# EAGLE design S7G7_footprint_simplified_w_ethernet_Power_Meter_v1p21 (EAGLE 9.6.2)
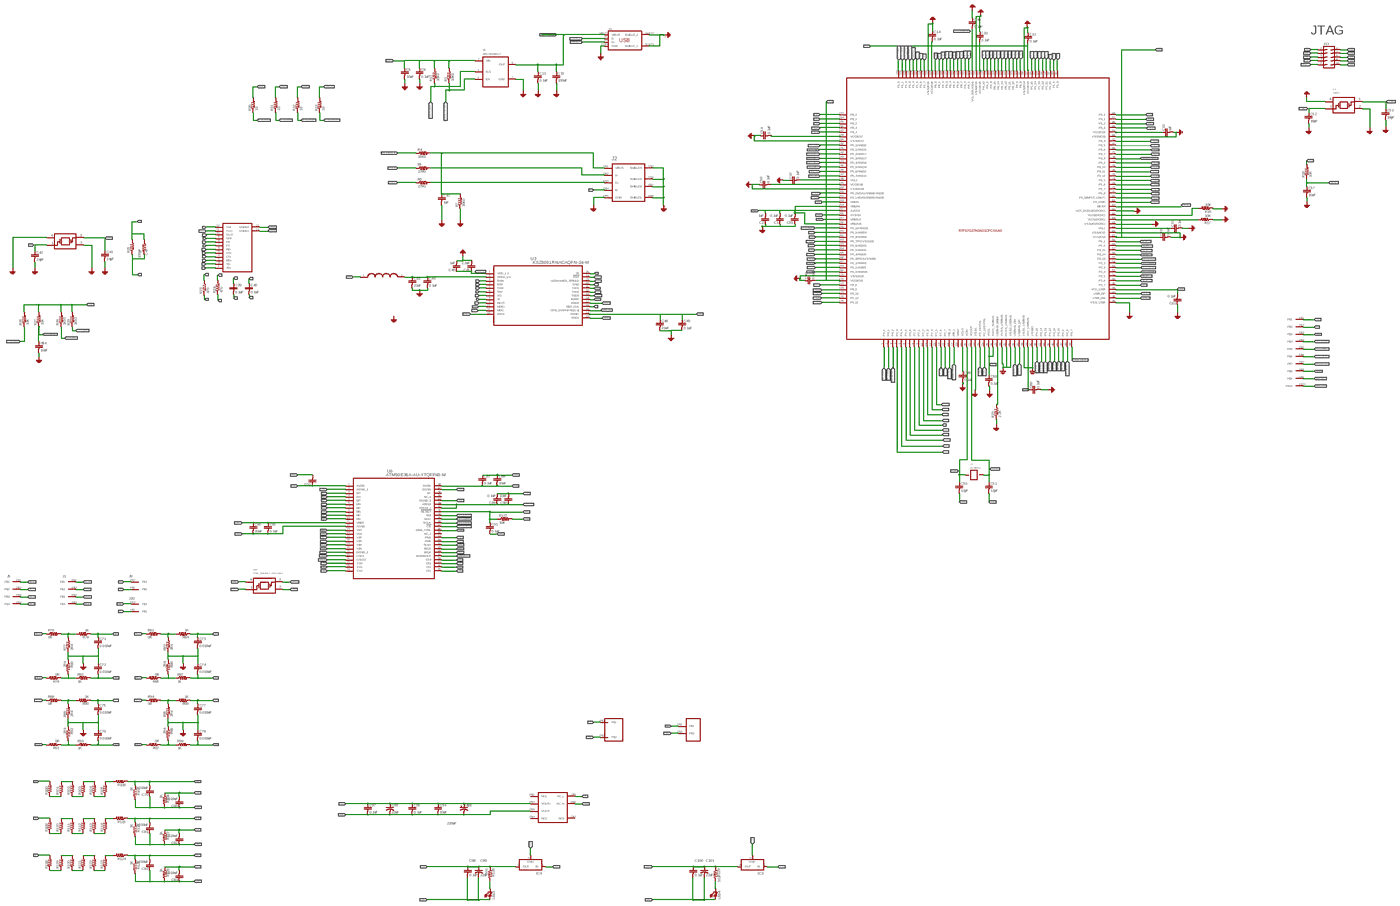
[diagram p0: schematic, sheet 1, overview]
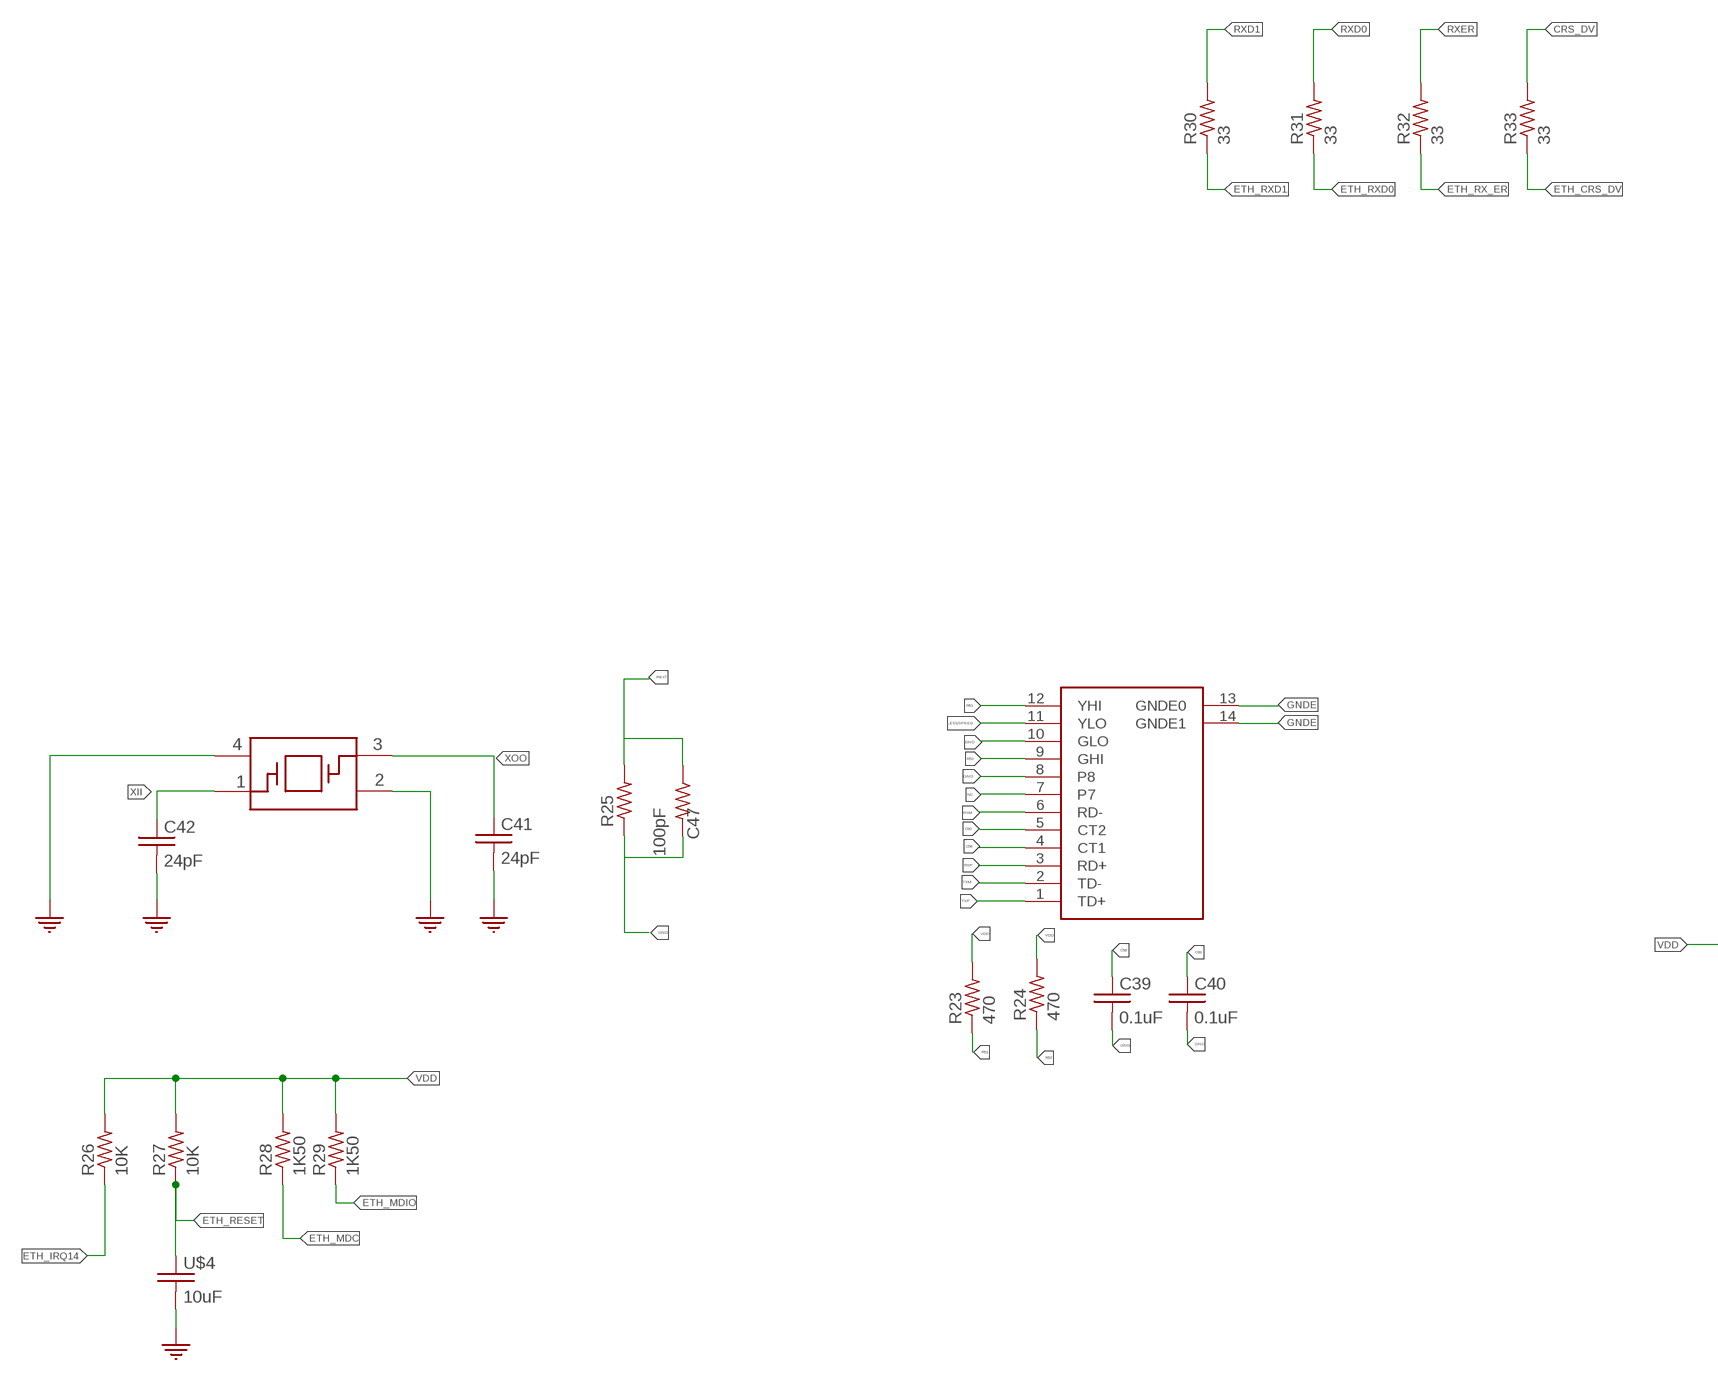
[diagram p1: schematic, sheet 1, part 1 of 6]
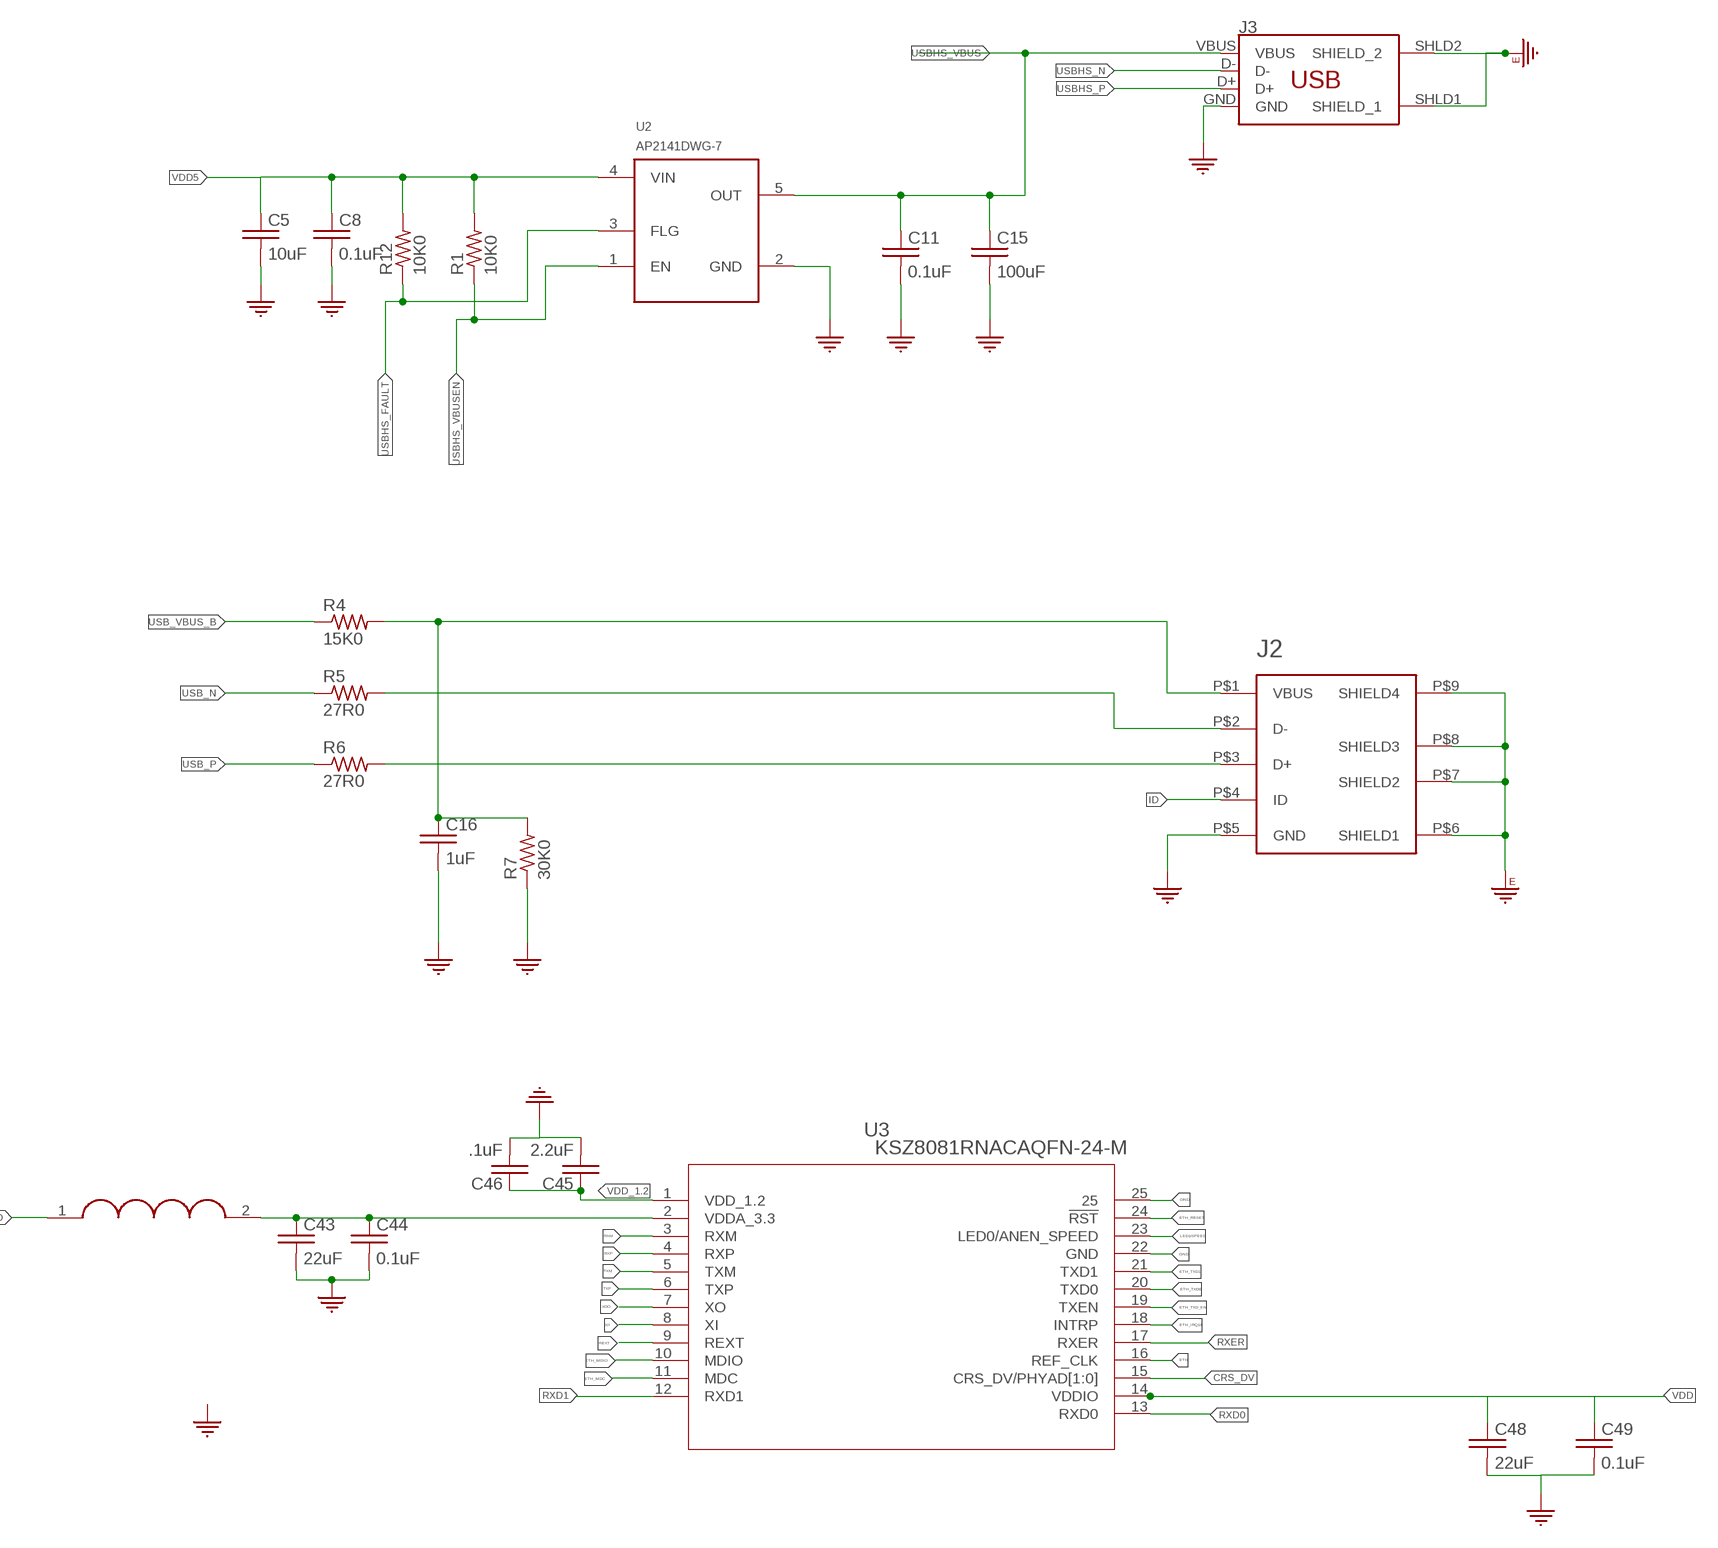
[diagram p2: schematic, sheet 1, part 2 of 6]
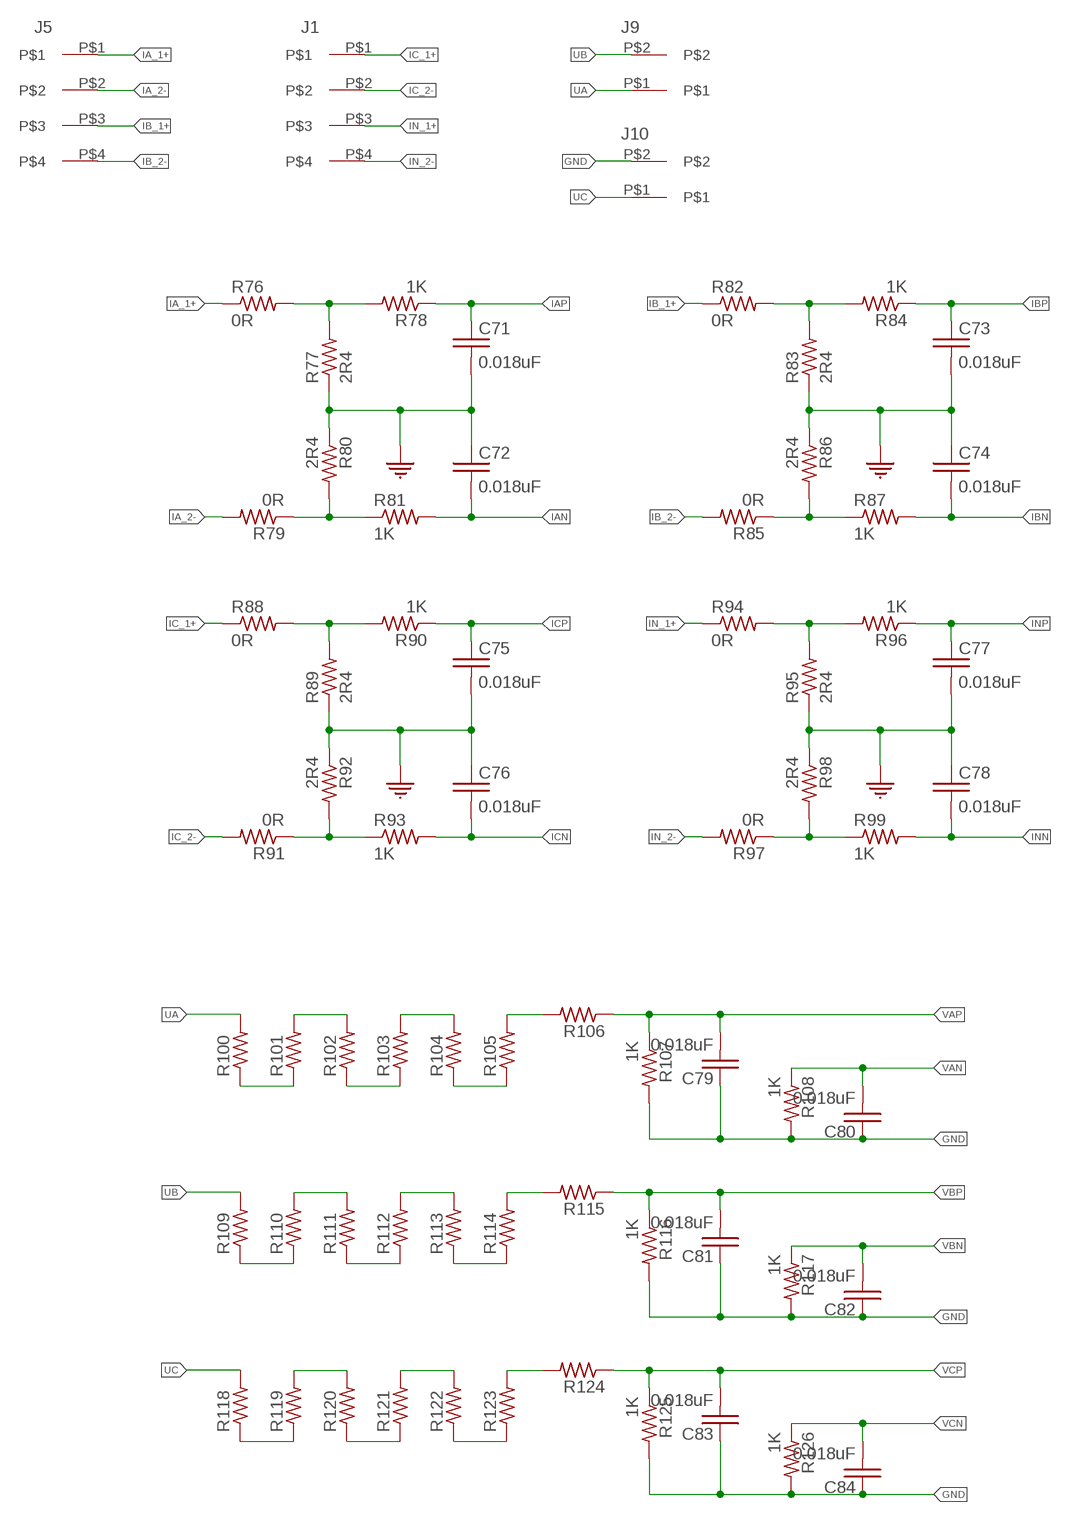
[diagram p3: schematic, sheet 1, part 3 of 6]
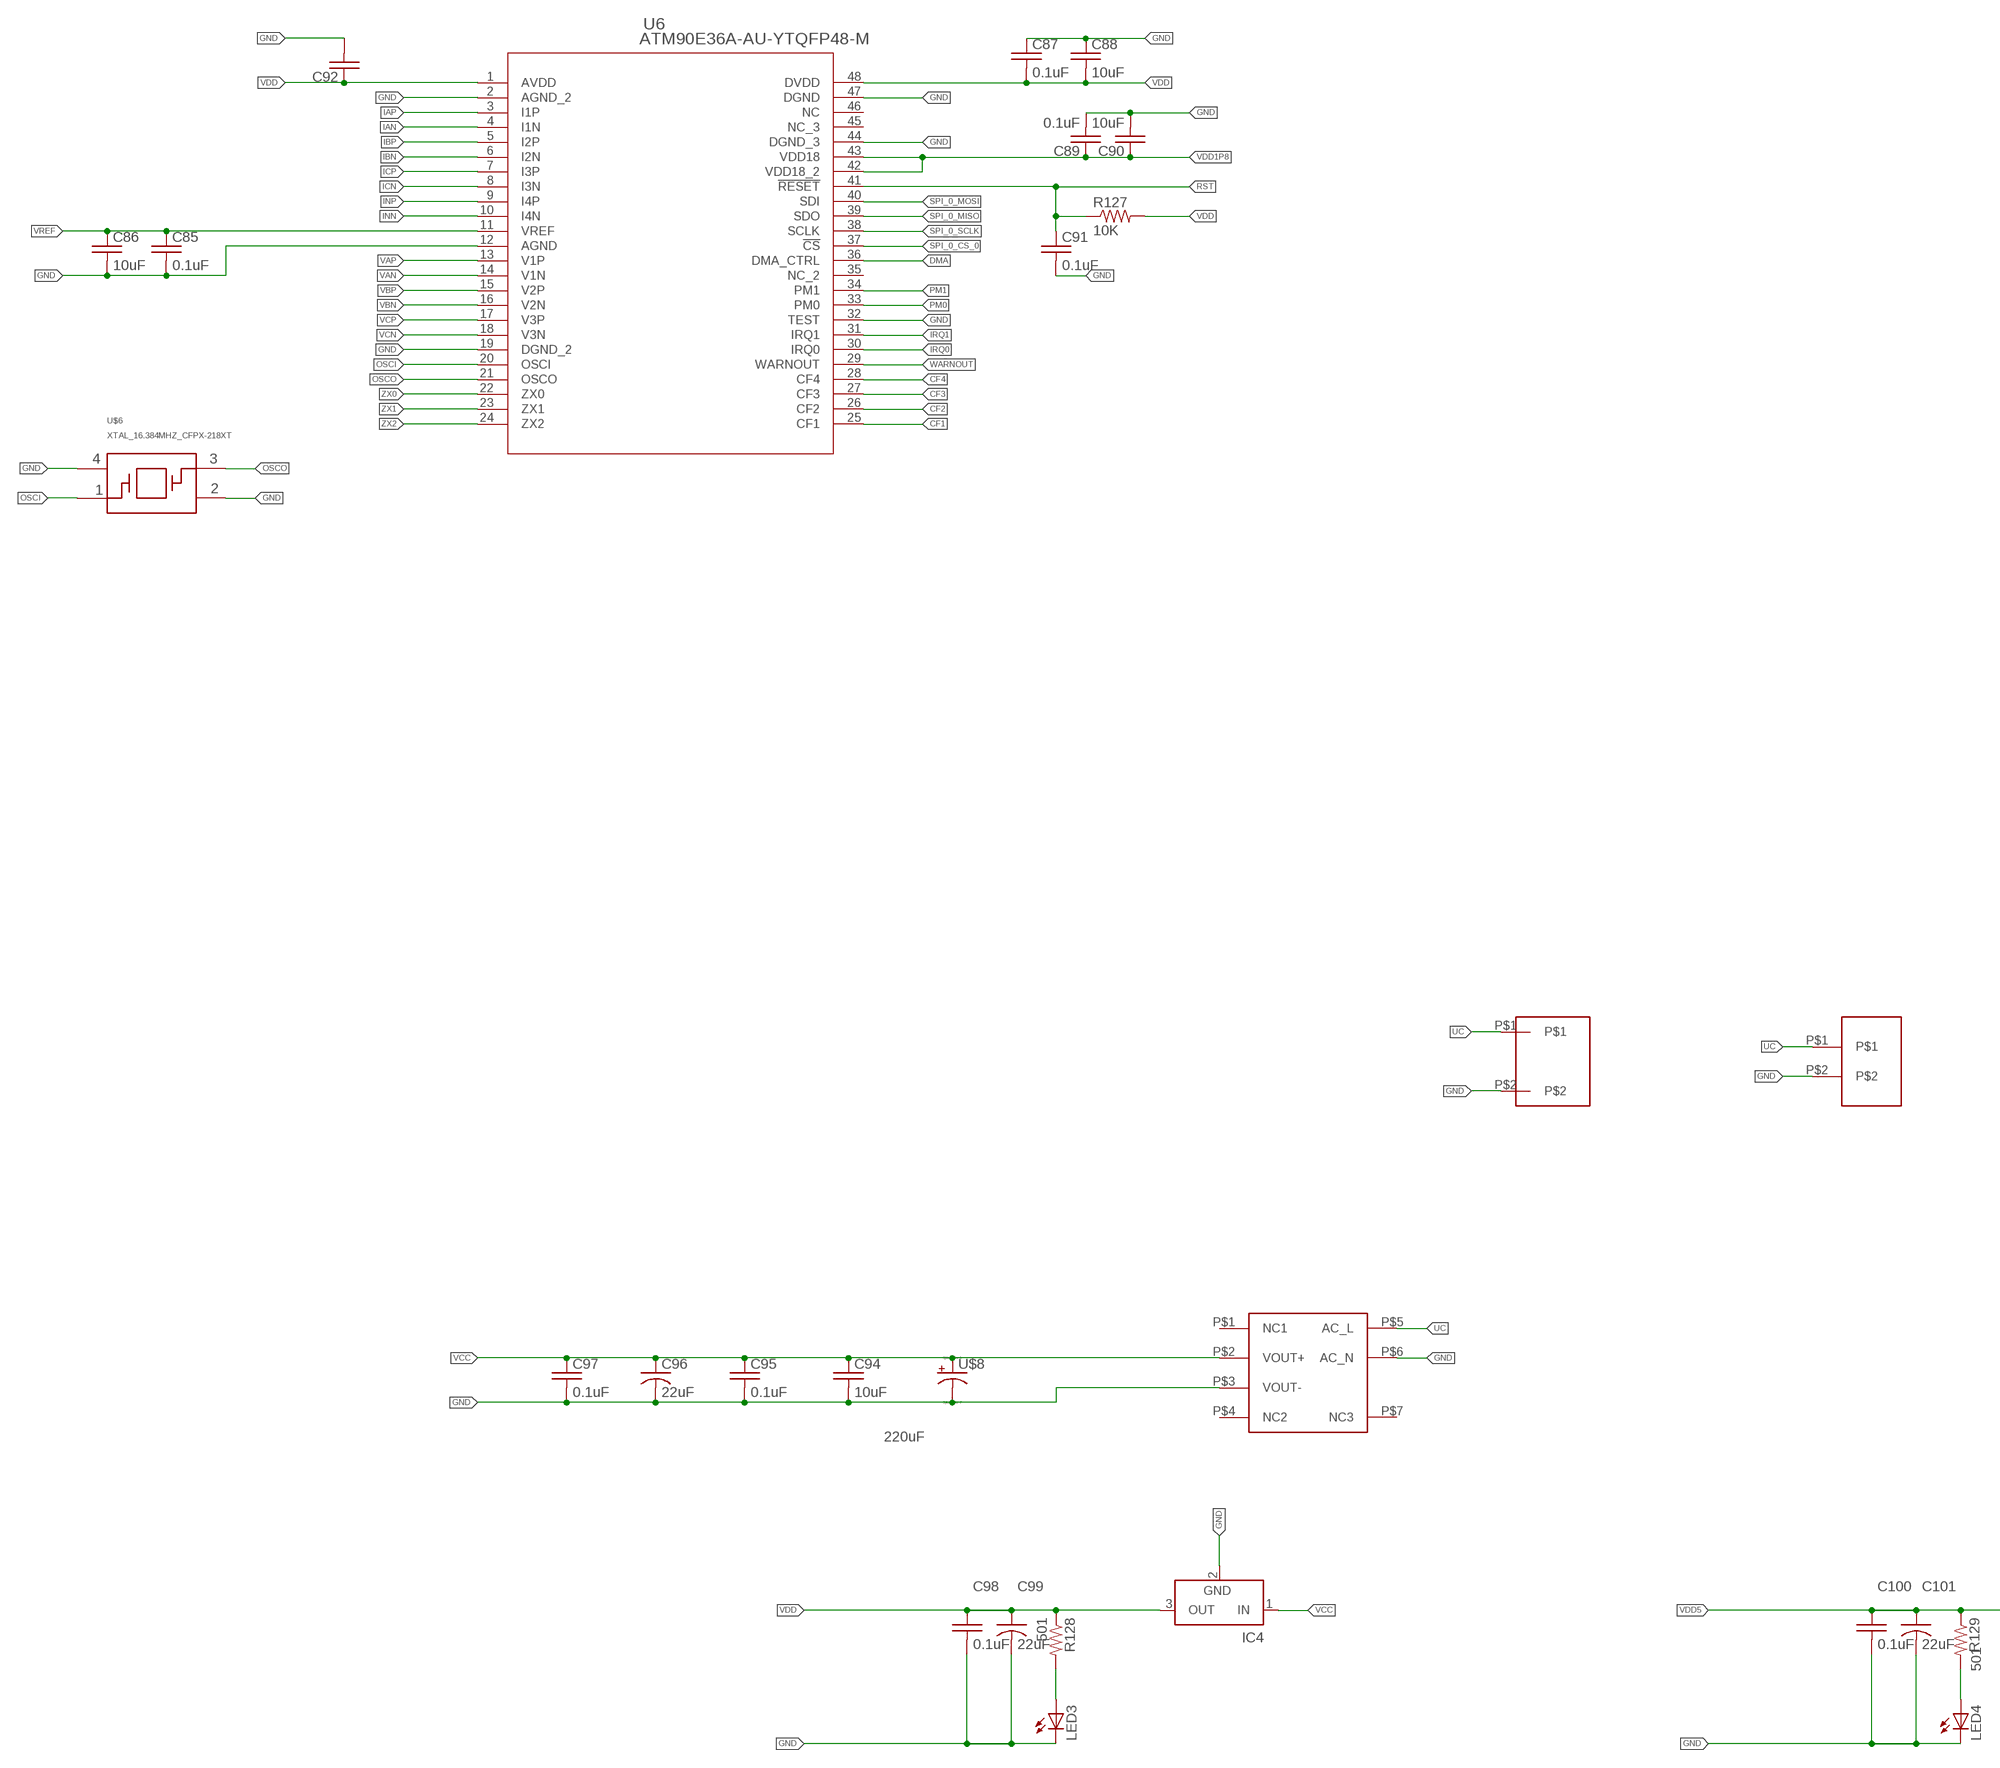
[diagram p4: schematic, sheet 1, part 4 of 6]
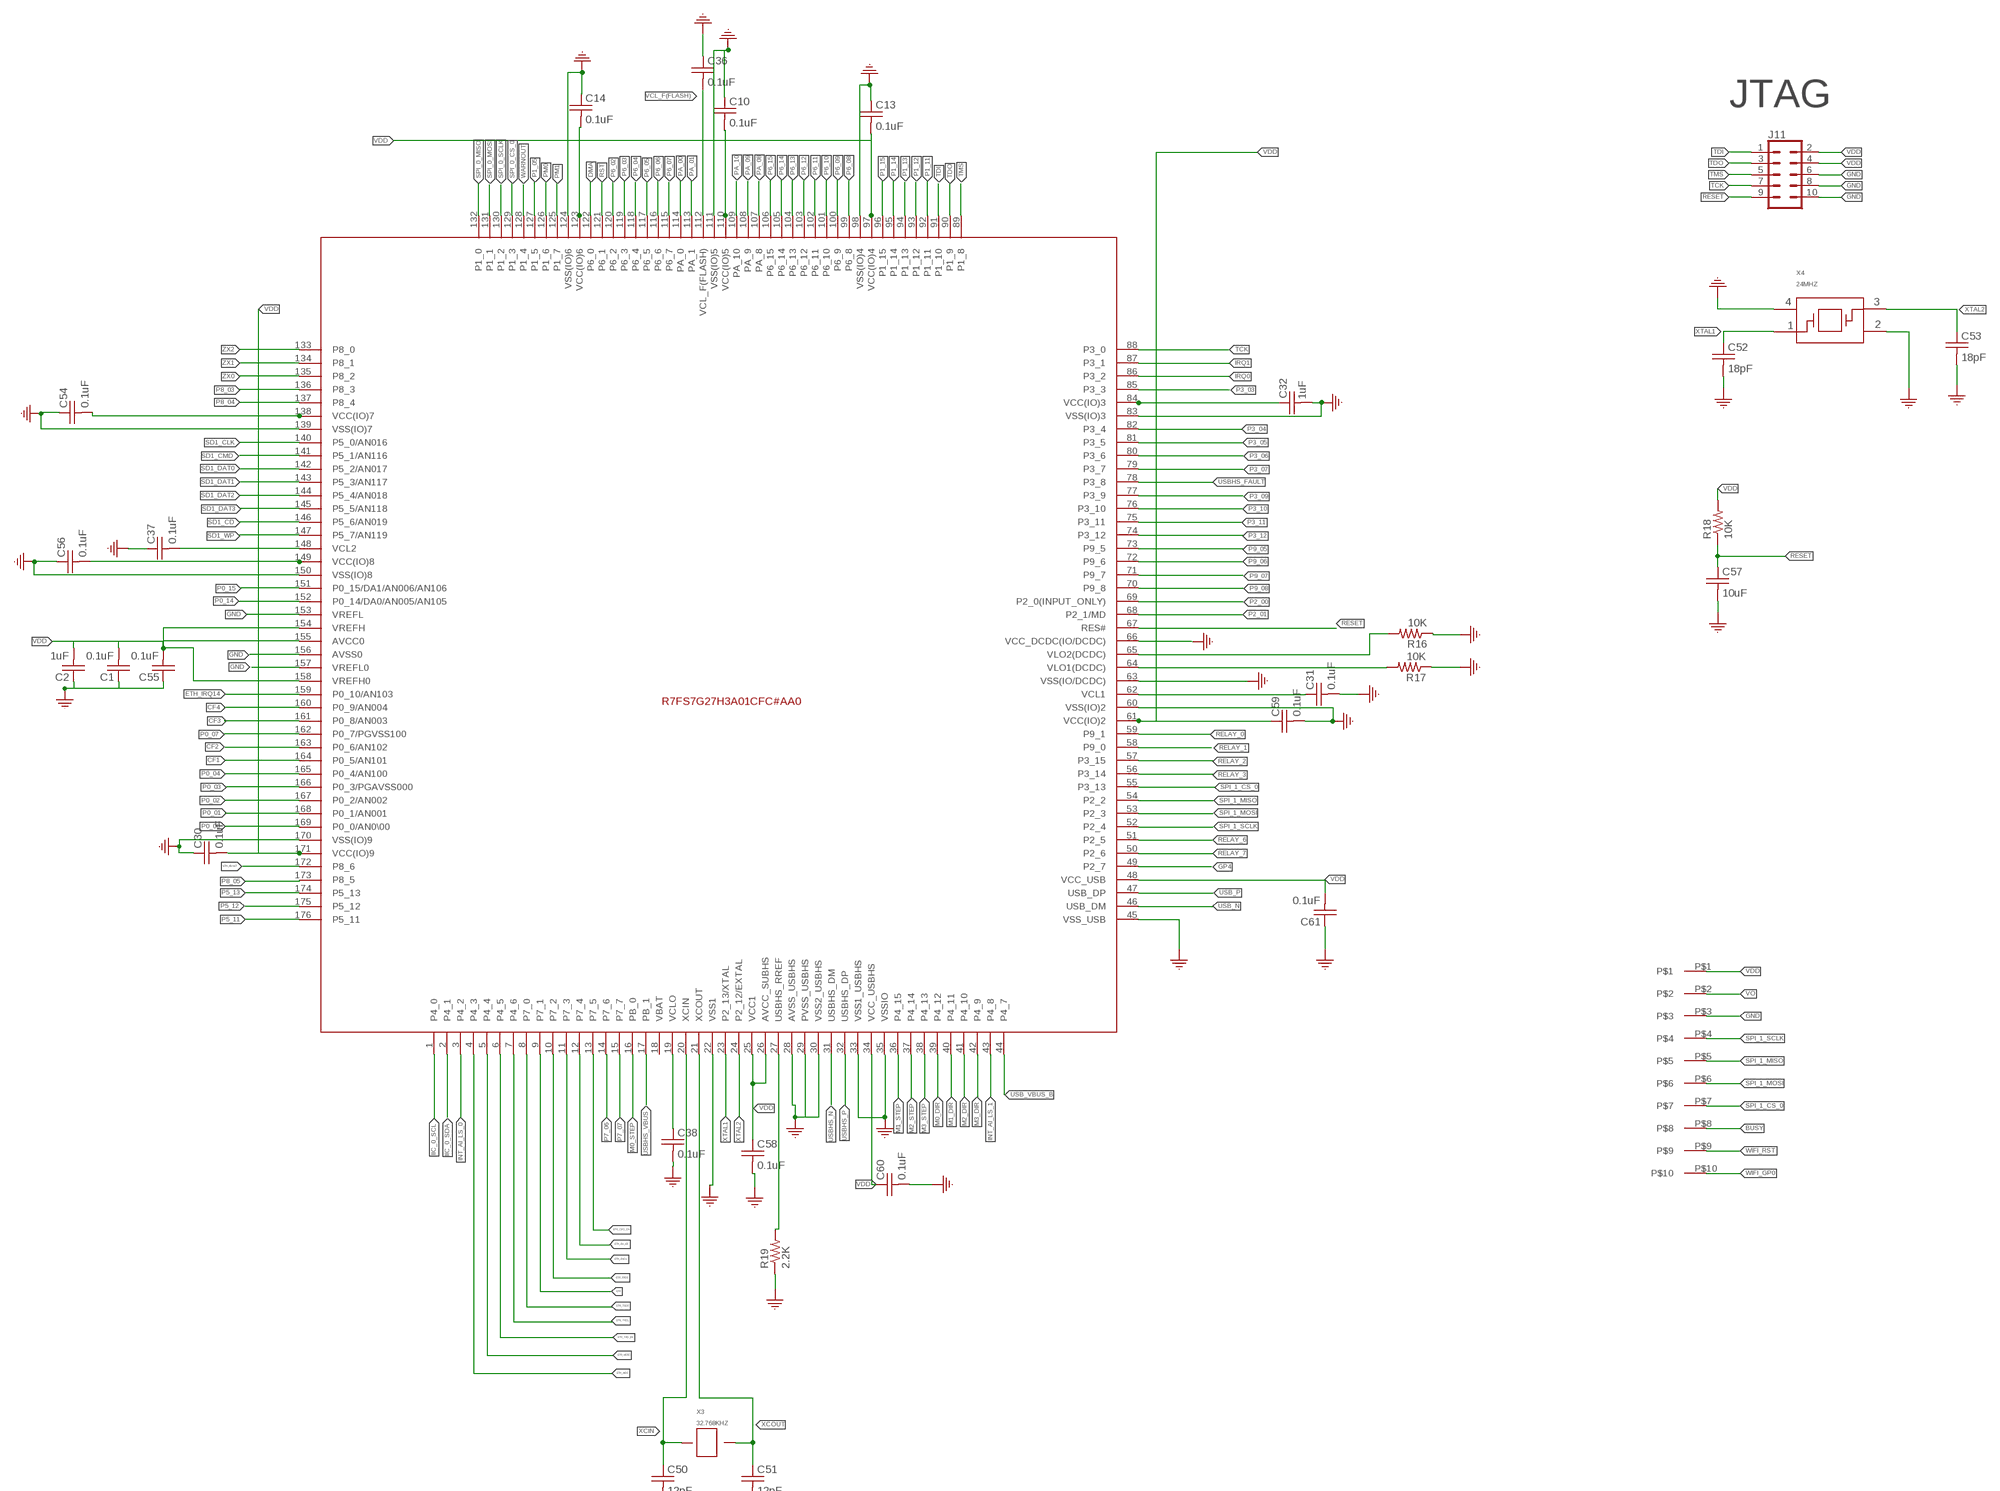
[diagram p5: schematic, sheet 1, part 5 of 6]
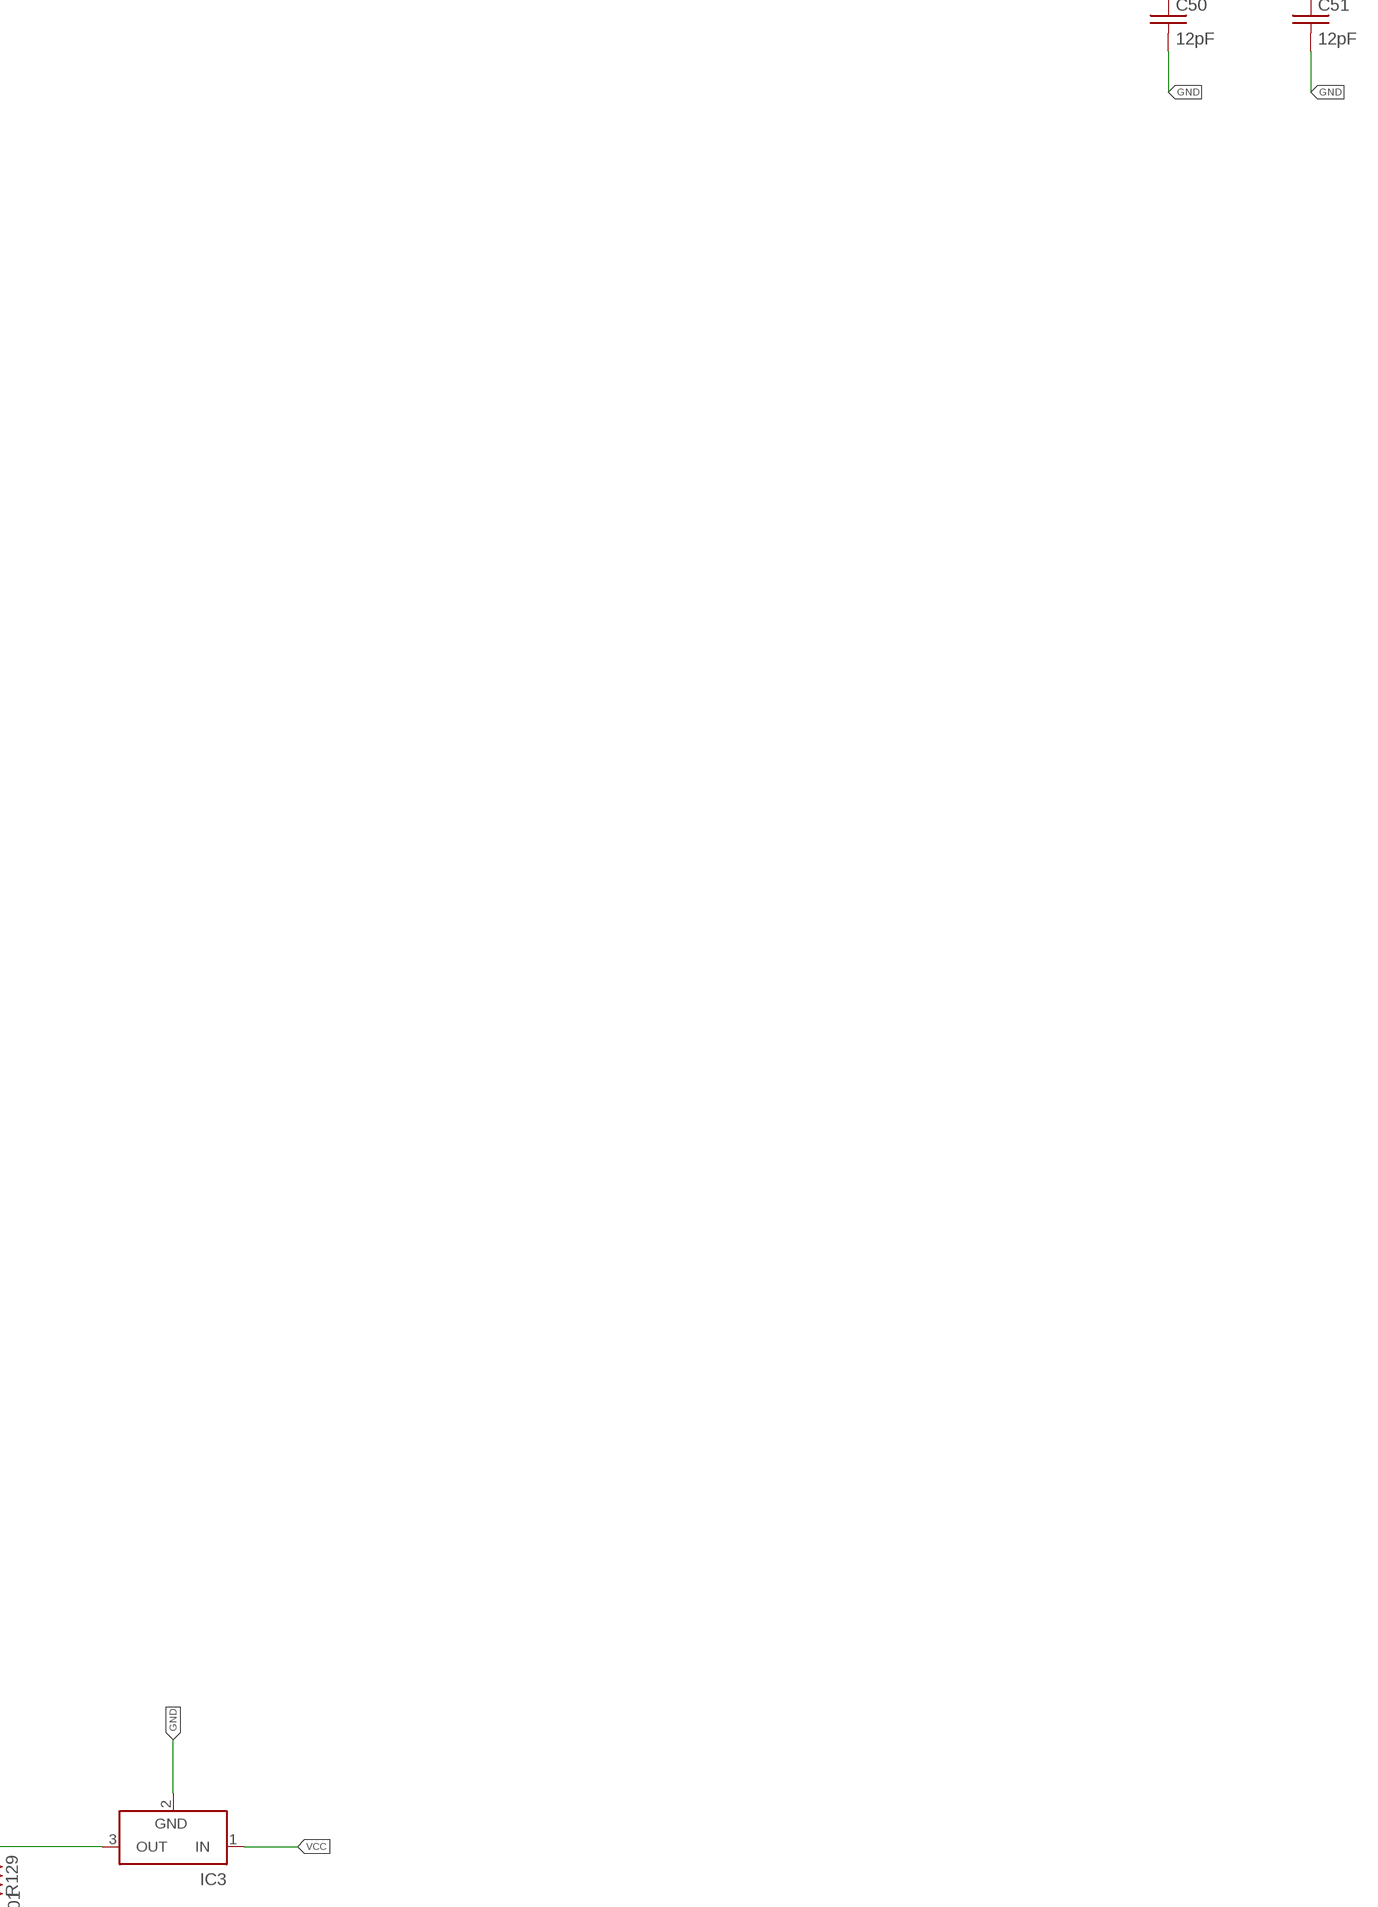
[diagram p6: schematic, sheet 1, part 6 of 6]

## Parts
C1  0.1uF  C_0402  [0402]
C2  1uF  C_0402  [0402]
C5  10uF  C_0402  [0402]
C8  0.1uF  C_0402  [0402]
C10  0.1uF  C_0402  [0402]
C11  0.1uF  C_0402  [0402]
C13  0.1uF  C_0402  [0402]
C14  0.1uF  C_0402  [0402]
C15  100uF  C_1210  [C1210]
C16  1uF  C_0402  [0402]
C30  0.1uF  C_0402  [0402]
C31  0.1uF  C_0402  [0402]
C32  1uF  C_0402  [0402]
C36  0.1uF  C_0402  [0402]
C37  0.1uF  C_0402  [0402]
C38  0.1uF  C_0402  [0402]
C39  0.1uF  C_0402  [0402]
C40  0.1uF  C_0402  [0402]
C41  24pF  C_0402  [0402]
C42  24pF  C_0402  [0402]
C43  22uF  C_0603  [0603]
C44  0.1uF  C_0402  [0402]
C45  2.2uF  C_0402  [0402]
C46  .1uF  C_0402  [0402]
C47  100pF  R_0402  [0402]
C48  22uF  C_0603  [0603]
C49  0.1uF  C_0402  [0402]
C50  12pF  C_0402  [0402]
C51  12pF  C_0402  [0402]
C52  18pF  C_0402  [0402]
C53  18pF  C_0402  [0402]
C54  0.1uF  C_0402  [0402]
C55  0.1uF  C_0402  [0402]
C56  0.1uF  C_0402  [0402]
C57  10uF  C_0402  [0402]
C58  0.1uF  C_0402  [0402]
C59  0.1uF  C_0402  [0402]
C60  0.1uF  C_0402  [0402]
C61  0.1uF  C_0402  [0402]
C71  0.018uF  C_0402  [0402]
C72  0.018uF  C_0402  [0402]
C73  0.018uF  C_0402  [0402]
C74  0.018uF  C_0402  [0402]
C75  0.018uF  C_0402  [0402]
C76  0.018uF  C_0402  [0402]
C77  0.018uF  C_0402  [0402]
C78  0.018uF  C_0402  [0402]
C79  0.018uF  C_0402  [0402]
C80  0.018uF  C_0402  [0402]
C81  0.018uF  C_0402  [0402]
C82  0.018uF  C_0402  [0402]
C83  0.018uF  C_0402  [0402]
C84  0.018uF  C_0402  [0402]
C85  0.1uF  C_0402  [0402]
C86  10uF  C_0402  [0402]
C87  0.1uF  C_0402  [0402]
C88  10uF  C_0402  [0402]
C89  0.1uF  C_0402  [0402]
C90  10uF  C_0402  [0402]
C91  0.1uF  C_0402  [0402]
C92  C_0402  [0402]
C93  CAP_THIN_FILM_TDK_32922CAP  [CAP_THIN_FILM_32922]
C94  10uF  C_0402  [0402]
C95  0.1uF  C_0402  [0402]
C96  22uF  C-USC1206  [C1206]
C97  0.1uF  C_0402  [0402]
C98  0.1uF  C_0402  [0402]
C99  22uF  C-USC1206  [C1206]
C100  0.1uF  C_0402  [0402]
C101  22uF  C-USC1206  [C1206]
FB2/2  FB_0805_120_OHM  [0805]
IC3  LT1129CST5  [SOT223]
IC4  LT1129CST3  [SOT223]
J1  3.81MM_1_X_4_RT_ANGLE_PLUG_HEADER  [1X4_3.81MM_PITCH]
J2  USB_MICRO-B  [USB_MICRO-B]
J3  USB_A  [USB_A_SMT]
J4  RJ45_WITH_ELEC  [RJ45_TH_ELEC]
J5  3.81MM_1_X_4_RT_ANGLE_PLUG_HEADER  [1X4_3.81MM_PITCH]
J9  3.81MM_1_X_2_RT_ANGLE_PLUG_HEADER  [2_3.81MM_PITCH]
J10  3.81MM_1_X_2_RT_ANGLE_PLUG_HEADER  [2_3.81MM_PITCH]
J11  CONN_05X2PTH  [2X5]
LED3  LED_0805_GREEN  [LED_0805_GREEN]
LED4  LED_0805_GREEN  [LED_0805_GREEN]
R1  10K0  R_0402  [0402]
R4  15K0  R_0402  [0402]
R5  27R0  R_0402  [0402]
R6  27R0  R_0402  [0402]
R7  30K0  R_0402  [0402]
R12  10K0  R_0402  [0402]
R16  10K  R_0402  [0402]
R17  10K  R_0402  [0402]
R18  10K  R_0402  [0402]
R19  2.2K  R_0402  [0402]
R23  470  R_0402  [0402]
R24  470  R_0402  [0402]
R25  6k49  R_0402  [0402]
R26  10K  R_0402  [0402]
R27  10K  R_0402  [0402]
R28  1K50  R_0402  [0402]
R29  1K50  R_0402  [0402]
R30  33  R_0402  [0402]
R31  33  R_0402  [0402]
R32  33  R_0402  [0402]
R33  33  R_0402  [0402]
R76  0R  R_0402  [0402]
R77  2R4  R_0402  [0402]
R78  1K  R_0402  [0402]
R79  0R  R_0402  [0402]
R80  2R4  R_0402  [0402]
R81  1K  R_0402  [0402]
R82  0R  R_0402  [0402]
R83  2R4  R_0402  [0402]
R84  1K  R_0402  [0402]
R85  0R  R_0402  [0402]
R86  2R4  R_0402  [0402]
R87  1K  R_0402  [0402]
R88  0R  R_0402  [0402]
R89  2R4  R_0402  [0402]
R90  1K  R_0402  [0402]
R91  0R  R_0402  [0402]
R92  2R4  R_0402  [0402]
R93  1K  R_0402  [0402]
R94  0R  R_0402  [0402]
R95  2R4  R_0402  [0402]
R96  1K  R_0402  [0402]
R97  0R  R_0402  [0402]
R98  2R4  R_0402  [0402]
R99  1K  R_0402  [0402]
R100  R_0402  [0402]
R101  R_0402  [0402]
R102  R_0402  [0402]
R103  R_0402  [0402]
R104  R_0402  [0402]
R105  R_0402  [0402]
R106  R_0402  [0402]
R107  1K  R_0402  [0402]
R108  1K  R_0402  [0402]
R109  R_0402  [0402]
R110  R_0402  [0402]
R111  R_0402  [0402]
R112  R_0402  [0402]
R113  R_0402  [0402]
R114  R_0402  [0402]
R115  R_0402  [0402]
R116  1K  R_0402  [0402]
R117  1K  R_0402  [0402]
R118  R_0402  [0402]
R119  R_0402  [0402]
R120  R_0402  [0402]
R121  R_0402  [0402]
R122  R_0402  [0402]
R123  R_0402  [0402]
R124  R_0402  [0402]
R125  1K  R_0402  [0402]
R126  1K  R_0402  [0402]
R127  10K  R_0402  [0402]
R128  501  R_0402  [0402]
R129  501  R_0402  [0402]
U2  AP2141DWG-5  [SOT-23-5]
U3  KSZ8081RNACAQFN-24-M  [QFN-24-M]
U4  S7G2_X_176  [LQFP176_24X24]
U6  ATM90E36A-AU-YTQFP48-M  [TQFP48-M]
U7  TMLM_04109  [TMLM04]
U$1  1_X_10_HEADER_GENERIC_.1INCH  [HEADER_1_X_10_.1_INCH]
U$3  XTAL_25_MHZ  [SMD_3225]
U$4  10uF  C_0402  [0402]
U$6  XTAL_16.384MHZ_CFPX-218XT  [XTAL_2.5X2.0]
U$7  VAR_10MM_VDRUS10  [VAR_10MM_VDRUS10]
U$8  220uF  C_AL_ELECTROLYTIC_SMD_220UF  [C_AL_ELECTROLYTIC_SMD_220UF]
X3  32.768KHZ  XTAL_32.768KHZ  [SMD_X_2_PADS]
X4  24MHZ  XTAL_24_MHZ  [SMD_3225]

## Nets
BUSY: U$1.P$8
C58: C39.P$1 J4.4(CT1)
C60: C40.P$1 J4.5(CT2)
CF1: U4.164(P0_5/AN101) U6.25(CF1)
CF2: U4.163(P0_6/AN102) U6.26(CF2)
CF3: U4.161(P0_8/AN003) U6.27(CF3)
CF4: U4.160(P0_9/AN004) U6.28(CF4)
CRS_DV: R33.P$2 U3.15(CRS_DV/PHYAD[1:0])
D+: J2.P$3(D+) R6.P$2
D-: J2.P$2(D-) R5.P$2
DMA: U4.122(P6_0) U6.36(DMA_CTRL)
ETH: U3.16(REF_CLK) U4.9(P7_1)
ETH_CRS_DV: R33.P$1 U4.13(P7_5)
ETH_IRQ14: R26.P$1 U3.18(INTRP) U4.159(P0_10/AN103)
ETH_MDC: R28.P$1 U3.11(MDC) U4.4(P4_3)
ETH_MDIO: R29.P$1 U3.10(MDIO) U4.5(P4_4)
ETH_RESET: R27.P$1 U3.24(!RST) U4.172(P8_6) U$4.P$1
ETH_RX_ER: R32.P$1 U4.12(P7_4)
ETH_RXD0: R31.P$1 U4.10(P7_2)
ETH_RXD1: R30.P$1 U4.11(P7_3)
ETH_TXD0: U3.20(TXD0) U4.8(P7_0)
ETH_TXD1: U3.21(TXD1) U4.7(P4_6)
ETH_TXD_EN: U3.19(TXEN) U4.6(P4_5)
GND: C1.P$1 C2.P$1 C5.P$2 C8.P$2 C10.P$1 C11.P$2 C13.P$1 C14.P$1 C15.2 C16.P$2 C30.P$1 C31.P$2 C32.P$2 C36.P$1 C37.P$1 C38.P$2 C39.P$2 C40.P$2 C41.P$2 C42.P$2 C43.2 C44.P$2 C45.P$2 C46.P$2 C47.P$2 C48.2 C49.P$2 C50.P$2 C51.P$2 C52.P$2 C53.P$2 C54.P$1 C55.P$1 C56.P$1 C57.P$2 C58.P$2 C59.P$2 C60.P$2 C61.P$1 C71.P$2 C72.P$1 C73.P$2 C74.P$1 C75.P$2 C76.P$1 C77.P$2 C78.P$1 C79.P$1 C80.P$1 C81.P$1 C82.P$1 C83.P$1 C84.P$1 C85.P$2 C86.P$2 C87.P$1 C88.P$1 C89.P$2 C90.P$2 C91.P$2 C92.P$2 C93.P$2 C94.P$2 C95.P$2 C96.2 C97.P$2 C98.P$2 C99.2 C100.P$2 C101.2 IC3.2(GND) IC4.2(GND) J2.P$5(GND) J3.GND J4.8 J4.10(GLO) J10.P$2 J11.6 J11.8 J11.10 LED3.C LED4.C R7.P$1 R16.P$1 R17.P$1 R19.P$1 R25.P$1 R77.P$1 R80.P$1 R83.P$1 R86.P$1 R89.P$1 R92.P$1 R95.P$1 R98.P$1 R107.P$2 R108.P$2 R116.P$2 R117.P$2 R125.P$2 R126.P$2 U2.2(GND) U3.22(GND) U3.25 U4.22(VSS1) U4.28(AVSS_USBHS) U4.29(PVSS_USBHS) U4.30(VSS2_USBHS) U4.33(VSS1_USBHS) U4.35(VSSIO) U4.45(VSS_USB) U4.60(VSS(IO)2) U4.63(VSS(IO/DCDC)) U4.66(VCC_DCDC(IO/DCDC)) U4.83(VSS(IO)3) U4.98(VSS(IO)4) U4.111(VSS(IO)5) U4.124(VSS(IO)6) U4.139(VSS(IO)7) U4.150(VSS(IO)8) U4.153(VREFL) U4.156(AVSS0) U4.157(VREFL0) U4.170(VSS(IO)9) U6.2(AGND_2) U6.12(AGND) U6.19(DGND_2) U6.32(TEST) U6.44(DGND_3) U6.47(DGND) U7.P$3(VOUT-) U7.P$6(AC_N) U$1.P$3 U$3.2 U$3.4 U$4.P$2 U$6.2 U$6.4 U$7.P$2 U$8.N-(-) X4.2 X4.4
GNDE: J2.P$6(SHIELD1) J2.P$7(SHIELD2) J2.P$8(SHIELD3) J2.P$9(SHIELD4) J3.SHLD1(SHIELD_1) J3.SHLD2(SHIELD_2) J4.13(GNDE0) J4.14(GNDE1)
GP4: U4.49(P2_7)
IA_1+: J5.P$1 R76.P$1
IA_2-: J5.P$2 R79.P$2
IAN: C72.P$2 R81.P$2 U6.4(I1N)
IAP: C71.P$1 R78.P$1 U6.3(I1P)
IB_1+: J5.P$3 R82.P$1
IB_2-: J5.P$4 R85.P$2
IBN: C74.P$2 R87.P$2 U6.6(I2N)
IBP: C73.P$1 R84.P$1 U6.5(I2P)
IC_1+: J1.P$1 R88.P$1
IC_2-: J1.P$2 R91.P$2
ICN: C76.P$2 R93.P$2 U6.8(I3N)
ICP: C75.P$1 R90.P$1 U6.7(I3P)
ID: J2.P$4(ID)
IIC_0_SCL: U4.1(P4_0)
IIC_0_SDA: U4.2(P4_1)
IN_1+: J1.P$3 R94.P$1
IN_2-: J1.P$4 R97.P$2
INN: C78.P$2 R99.P$2 U6.10(I4N)
INP: C77.P$1 R96.P$1 U6.9(I4P)
INT_AI_LS_0: U4.3(P4_2)
INT_AI_LS_1: U4.43(P4_8)
IRQ0: U4.86(P3_2) U6.30(IRQ0)
IRQ1: U4.87(P3_1) U6.31(IRQ1)
LED1/SPEED: J4.11(YLO) U3.23(LED0/ANEN_SPEED)
M0_DIR: U4.39(P4_12)
M0_STEP: U4.16(PB_0)
M1_DIR: U4.40(P4_11)
M1_STEP: U4.36(P4_15)
M2_DIR: U4.41(P4_10)
M2_STEP: U4.37(P4_14)
M3_DIR: U4.42(P4_9)
M3_STEP: U4.38(P4_13)
N$1: C37.P$2 U4.148(VCL2)
N$4: C38.P$1 U4.19(VCLO)
N$5: C31.P$1 U4.62(VCL1)
N$6: R17.P$2 U4.64(VLO1(DCDC))
N$7: R16.P$2 U4.65(VLO2(DCDC))
N$8: R19.P$2 U4.27(USBHS_RREF)
N$35: R76.P$2 R77.P$2 R78.P$2
N$36: R79.P$1 R80.P$2 R81.P$1
N$37: R82.P$2 R83.P$2 R84.P$2
N$38: R85.P$1 R86.P$2 R87.P$1
N$39: R88.P$2 R89.P$2 R90.P$2
N$40: R91.P$1 R92.P$2 R93.P$1
N$41: R94.P$2 R95.P$2 R96.P$2
N$42: R97.P$1 R98.P$2 R99.P$1
N$43: R100.P$1 R101.P$1
N$44: R101.P$2 R102.P$2
N$45: R102.P$1 R103.P$1
N$46: R103.P$2 R104.P$2
N$47: R104.P$1 R105.P$1
N$48: R105.P$2 R106.P$2
N$49: R109.P$1 R110.P$1
N$50: R110.P$2 R111.P$2
N$51: R111.P$1 R112.P$1
N$52: R112.P$2 R113.P$2
N$53: R113.P$1 R114.P$1
N$54: R114.P$2 R115.P$2
N$55: R118.P$1 R119.P$1
N$56: R119.P$2 R120.P$2
N$57: R120.P$1 R121.P$1
N$58: R121.P$2 R122.P$2
N$59: R122.P$1 R123.P$1
N$60: R123.P$2 R124.P$2
N$61: LED3.A R128.P$2
N$62: LED4.A R129.P$2
NC: J4.7
OSCI: U6.20(OSCI) U$6.1
OSCO: U6.21(OSCO) U$6.3
P0_00: U4.169(P0_0/AN0\00)
P0_01: U4.168(P0_1/AN001)
P0_02: U4.167(P0_2/AN002)
P0_03: U4.166(P0_3/PGAVSS000)
P0_04: U4.165(P0_4/AN100)
P0_07: U4.162(P0_7/PGVSS100)
P0_14: U4.152(P0_14/DA0/AN005/AN105)
P0_15: U4.151(P0_15/DA1/AN006/AN106)
P1_05: U4.127(P1_5)
P1_11: U4.92(P1_11)
P1_12: U4.93(P1_12)
P1_13: U4.94(P1_13)
P1_14: U4.95(P1_14)
P1_15: U4.96(P1_15)
P2_00: U4.69(P2_0(INPUT_ONLY))
P2_01: U4.68(P2_1/MD)
P3_03: U4.85(P3_3)
P3_04: U4.82(P3_4)
P3_05: U4.81(P3_5)
P3_06: U4.80(P3_6)
P3_07: U4.79(P3_7)
P3_09: U4.77(P3_9)
P3_10: U4.76(P3_10)
P3_11: U4.75(P3_11)
P3_12: U4.74(P3_12)
P5_11: U4.176(P5_11)
P5_12: U4.175(P5_12)
P5_13: U4.174(P5_13)
P6_02: U4.120(P6_2)
P6_03: U4.119(P6_3)
P6_04: U4.118(P6_4)
P6_05: U4.117(P6_5)
P6_06: U4.116(P6_6)
P6_07: U4.115(P6_7)
P6_08: U4.99(P6_8)
P6_09: U4.100(P6_9)
P6_10: U4.101(P6_10)
P6_11: U4.102(P6_11)
P6_12: U4.103(P6_12)
P6_13: U4.104(P6_13)
P6_14: U4.105(P6_14)
P6_15: U4.106(P6_15)
P7_06: U4.14(P7_6)
P7_07: U4.15(P7_7)
P8_03: U4.136(P8_3)
P8_04: U4.137(P8_4)
P8_05: U4.173(P8_5)
P9_05: U4.73(P9_5)
P9_06: U4.72(P9_6)
P9_07: U4.71(P9_7)
P9_08: U4.70(P9_8)
PA_00: U4.114(PA_0)
PA_01: U4.113(PA_1)
PA_08: U4.107(PA_8)
PA_09: U4.108(PA_9)
PA_10: U4.109(PA_10)
PM0: U4.126(P1_6) U6.33(PM0)
PM1: U4.125(P1_7) U6.34(PM1)
R51: J4.12(YHI) R23.P$1
R52: J4.9(GHI) R24.P$1
RELAY_0: U4.59(P9_1)
RELAY_1: U4.58(P9_0)
RELAY_2: U4.57(P3_15)
RELAY_3: U4.56(P3_14)
RELAY_6: U4.51(P2_5)
RELAY_7: U4.50(P2_6)
RESET: C57.P$1 J11.9 R18.P$1 U4.67(RES#)
REXT: C47.P$1 R25.P$2 U3.9(REXT)
RST: C91.P$1 R127.P$1 U4.121(P6_1) U6.41(!RESET)
RXD0: R31.P$2 U3.13(RXD0)
RXD1: R30.P$2 U3.12(RXD1)
RXER: R32.P$2 U3.17(RXER)
RXM: J4.6(RD-) U3.3(RXM)
RXP: J4.3(RD+) U3.4(RXP)
SD1_CD: U4.146(P5_6/AN019)
SD1_CLK: U4.140(P5_0/AN016)
SD1_CMD: U4.141(P5_1/AN116)
SD1_DAT0: U4.142(P5_2/AN017)
SD1_DAT1: U4.143(P5_3/AN117)
SD1_DAT2: U4.144(P5_4/AN018)
SD1_DAT3: U4.145(P5_5/AN118)
SD1_WP: U4.147(P5_7/AN119)
SPI_0_CS_0: U4.129(P1_3) U6.37(!CS)
SPI_0_MISO: U4.132(P1_0) U6.39(SDO)
SPI_0_MOSI: U4.131(P1_1) U6.40(SDI)
SPI_0_SCLK: U4.130(P1_2) U6.38(SCLK)
SPI_1_CS_0: U4.55(P3_13) U$1.P$7
SPI_1_MISO: U4.54(P2_2) U$1.P$5
SPI_1_MOSI: U4.53(P2_3) U$1.P$6
SPI_1_SCLK: U4.52(P2_4) U$1.P$4
TCK: J11.7 U4.88(P3_0)
TDI: J11.1 U4.91(P1_10)
TDO: J11.3 U4.90(P1_9)
TMS: J11.5 U4.89(P1_8)
TXM: J4.2(TD-) U3.5(TXM)
TXP: J4.1(TD+) U3.6(TXP)
UA: J9.P$1 R100.P$2
UB: J9.P$2 R109.P$2
UC: C93.P$1 J10.P$1 R118.P$2 U7.P$5(AC_L) U$7.P$1
USB_N: R5.P$1 U4.46(USB_DM)
USB_P: R6.P$1 U4.47(USB_DP)
USB_VBUS_B: R4.P$1 U4.44(P4_7)
USBHS_FAULT: R12.P$1 U2.3(FLG) U4.78(P3_8)
USBHS_N: J3.D- U4.31(USBHS_DM)
USBHS_P: J3.D+ U4.32(USBHS_DP)
USBHS_VBUS: C11.P$1 C15.1 J3.VBUS U2.5(OUT) U4.17(PB_1)
USBHS_VBUSEN: R1.P$1 U2.1(EN)
VAN: C80.P$2 R108.P$1 U6.14(V1N)
VAP: C79.P$2 R106.P$1 R107.P$1 U6.13(V1P)
VBN: C82.P$2 R117.P$1 U6.16(V2N)
VBP: C81.P$2 R115.P$1 R116.P$1 U6.15(V2P)
VBUS: C16.P$1 J2.P$1(VBUS) R4.P$2 R7.P$2
VCC: C94.P$1 C95.P$1 C96.1 C97.P$1 IC3.1(IN) IC4.1(IN) U7.P$2(VOUT+) U$8.P+(+)
VCL_F(FLASH): C36.P$2 U4.112(VCL_F(FLASH))
VCN: C84.P$2 R126.P$1 U6.18(V3N)
VCP: C83.P$2 R124.P$1 R125.P$1 U6.17(V3P)
VDD: C1.P$2 C2.P$2 C10.P$2 C13.P$2 C14.P$2 C30.P$2 C32.P$1 C48.1 C49.P$1 C54.P$2 C55.P$2 C56.P$2 C58.P$1 C59.P$1 C60.P$1 C61.P$2 C87.P$2 C88.P$2 C92.P$1 C98.P$1 C99.1 FB2/2.1 IC4.3(OUT) J11.2 J11.4 R18.P$2 R23.P$2 R24.P$2 R26.P$2 R27.P$2 R28.P$2 R29.P$2 R127.P$2 R128.P$1 U3.14(VDDIO) U4.25(VCC1) U4.26(AVCC_SUBHS) U4.34(VCC_USBHS) U4.48(VCC_USB) U4.61(VCC(IO)2) U4.84(VCC(IO)3) U4.97(VCC(IO)4) U4.110(VCC(IO)5) U4.123(VCC(IO)6) U4.138(VCC(IO)7) U4.149(VCC(IO)8) U4.154(VREFH) U4.155(AVCC0) U4.158(VREFH0) U4.171(VCC(IO)9) U6.1(AVDD) U6.48(DVDD) U$1.P$1
VDD1P8: C89.P$1 C90.P$1 U6.42(VDD18_2) U6.43(VDD18)
VDD5: C5.P$1 C8.P$1 C100.P$1 C101.1 IC3.3(OUT) R1.P$2 R12.P$2 R129.P$1 U2.4(VIN)
VDD_1.2: C45.P$1 C46.P$1 U3.1(VDD_1.2)
VDD_ENET1: C43.1 C44.P$1 FB2/2.2 U3.2(VDDA_3.3)
VO: U$1.P$2
VREF: C85.P$1 C86.P$1 U6.11(VREF)
WARNOUT: U4.128(P1_4) U6.29(WARNOUT)
WIFI_GP0: U$1.P$10
WIFI_RST: U$1.P$9
XCIN: C50.P$1 U4.20(XCIN) X3.P$1
XCOUT: C51.P$1 U4.21(XCOUT) X3.P$2
XII: C42.P$1 U3.8(XI) U$3.1
XOO: C41.P$1 U3.7(XO) U$3.3
XTAL1: C52.P$1 U4.23(P2_13/XTAL) X4.1
XTAL2: C53.P$1 U4.24(P2_12/EXTAL) X4.3
ZX0: U4.135(P8_2) U6.22(ZX0)
ZX1: U4.134(P8_1) U6.23(ZX1)
ZX2: U4.133(P8_0) U6.24(ZX2)
Unconnected: U4.18(VBAT) U6.35(NC_2) U6.45(NC_3) U6.46(NC) U7.P$1(NC1) U7.P$4(NC2) U7.P$7(NC3)

## Notes on the sheet
- JTAG

## Power pins joined to a net without a drawn wire
GND: IC3.4(GND) IC4.4(GND)

## Library data of the parts
C1 C2 C5 C8 C10 C11 C13 C14 C16 C30-C32 C36-C42 C44-C46 C49-C61 C71-C92 C94 C95 C97 C98 C100 U$4 = 3D_MIG_Controller:C_0402
C15 = 3D_MIG_Controller:C_1210
C43 C48 = 3D_MIG_Controller:C_0603
C47 R1 R4-R7 R12 R16-R19 R23-R33 R76-R129 = 3D_MIG_Controller:R_0402
C93 = 3D_MIG_Controller:CAP_THIN_FILM_TDK_32922
C96 C99 C101 = 3D_MIG_Controller:C-US: CAPACITOR, American symbol
FB2/2 = 3D_MIG_Controller:FB_0805_120_OHM
IC3 = 3D_MIG_Controller:LT1129CST5: VOLTAGE REGULATOR with shutdown; MPN: LT1129CST-5#PBF; OC_FARNELL: 1663375; OC_NEWARK: 57M2069
IC4 = 3D_MIG_Controller:LT1129CST3: VOLTAGE REGULATOR with shutdown; MPN: LT1129CST-5#PBF; OC_FARNELL: 1663375; OC_NEWARK: 57M2069
J1 J5 = 3D_MIG_Controller:3.81MM_1_X_4_RT_ANGLE_PLUG_HEADER
J2 = 3D_MIG_Controller:USB_MICRO-B
J3 = 3D_MIG_Controller:USB_A: USB-A Connector Male and female variants, as well as PTH and SMT variants SparkFun Products: SparkFun XBee Explorer Dongle <https://www.sparkfun.com/products/11697> PTH Male SparkFun MicroView-USB Programmer <https://www.sparkfun.com/products/12924> SMT Male SparkFun USB Type A Female Breakout <https://www.sparkfun.com/products/12700> SMT Female
J4 = 3D_MIG_Controller:RJ45_WITH_ELEC
J9 J10 = 3D_MIG_Controller:3.81MM_1_X_2_RT_ANGLE_PLUG_HEADER
J11 = 3D_MIG_Controller:CONN_05X2: Multi connection point. Often used as Generic Header-pin footprint for 0.1 inch spaced/style header connections For AVR SPI programming port, see special device with nice symbol: "AVR_SPI_PROG_5x2.dev" You can populate with any combo of single row headers, but if you'd like an exact match, check these: 2x5 AVR ICSP Male Header <https://www.sparkfun.com/products/778> (PRT-00778) 2x5 Pin Shrouded Header <https://www.sparkfun.com/products/8506> (PRT-08506) On any of the 0.1 inch spaced packages, you can populate with these: Break Away Headers - Straight <https://www.sparkfun.com/products/116> (PRT-00116) Break Away Male Headers - Right Angle <https://www.sparkfun.com/products/553> (PRT-00553) Female Headers <https://www.sparkfun.com/products/115> (PRT-00115) Break Away Headers - Machine Pin <https://www.sparkfun.com/products/117> (PRT-00117) Break Away Female Headers - Swiss Machine Pin <https://www.sparkfun.com/products/743> (PRT-00743) Special note: the shrouded connector mates well with our 5x2 ribbon cables: 2x5 Pin IDC Ribbon Cable <https://www.sparkfun.com/products/8535> (PRT-08535); PROD_ID: CONN-08499; SF_ID: PRT-0778
LED3 LED4 = 3D_MIG_Controller:LED_0805_GREEN
U2 = 3D_MIG_Controller:AP2141DWG-5
U3 = 3D_MIG_Controller:KSZ8081RNACA; MANUFACTURER_PART_NUMBER: KSZ8081RNACA; VENDOR: Micrel
U4 = 3D_MIG_Controller:S7G2_X_176
U6 = 3D_MIG_Controller:ATM90E36A-AU-Y; MANUFACTURER_PART_NUMBER: ATM90E36AAUY; VENDOR: Atmel
U7 = 3D_MIG_Controller:TMLM_04109
U$1 = 3D_MIG_Controller:1_X_10_HEADER_GENERIC_.1INCH
U$3 = 3D_MIG_Controller:XTAL_25_MHZ
U$6 = 3D_MIG_Controller:XTAL_16.384MHZ_CFPX-218
U$7 = 3D_MIG_Controller:VAR_10MM_VDRUS10
U$8 = 3D_MIG_Controller:C_AL_ELECTROLYTIC_SMD_220UF
X3 = 3D_MIG_Controller:XTAL_32.768KHZ
X4 = 3D_MIG_Controller:XTAL_24_MHZ

## Board
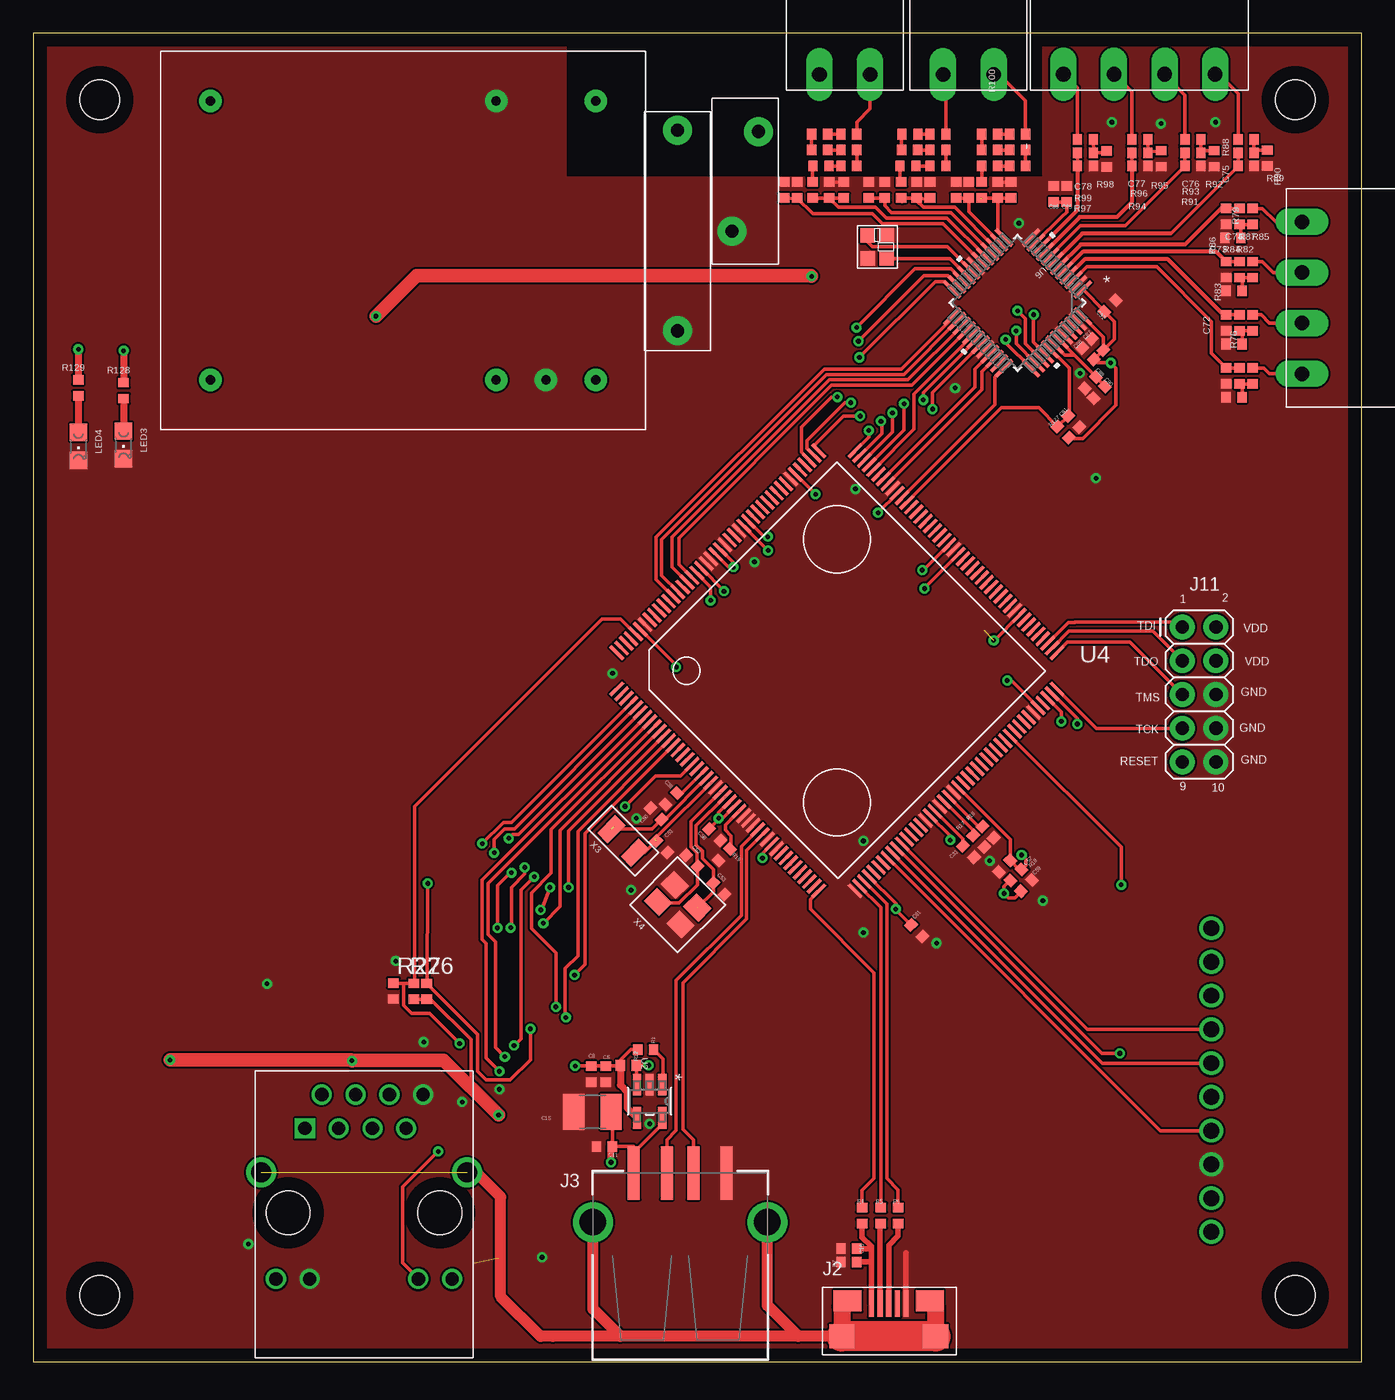
[diagram p7: board, top side]
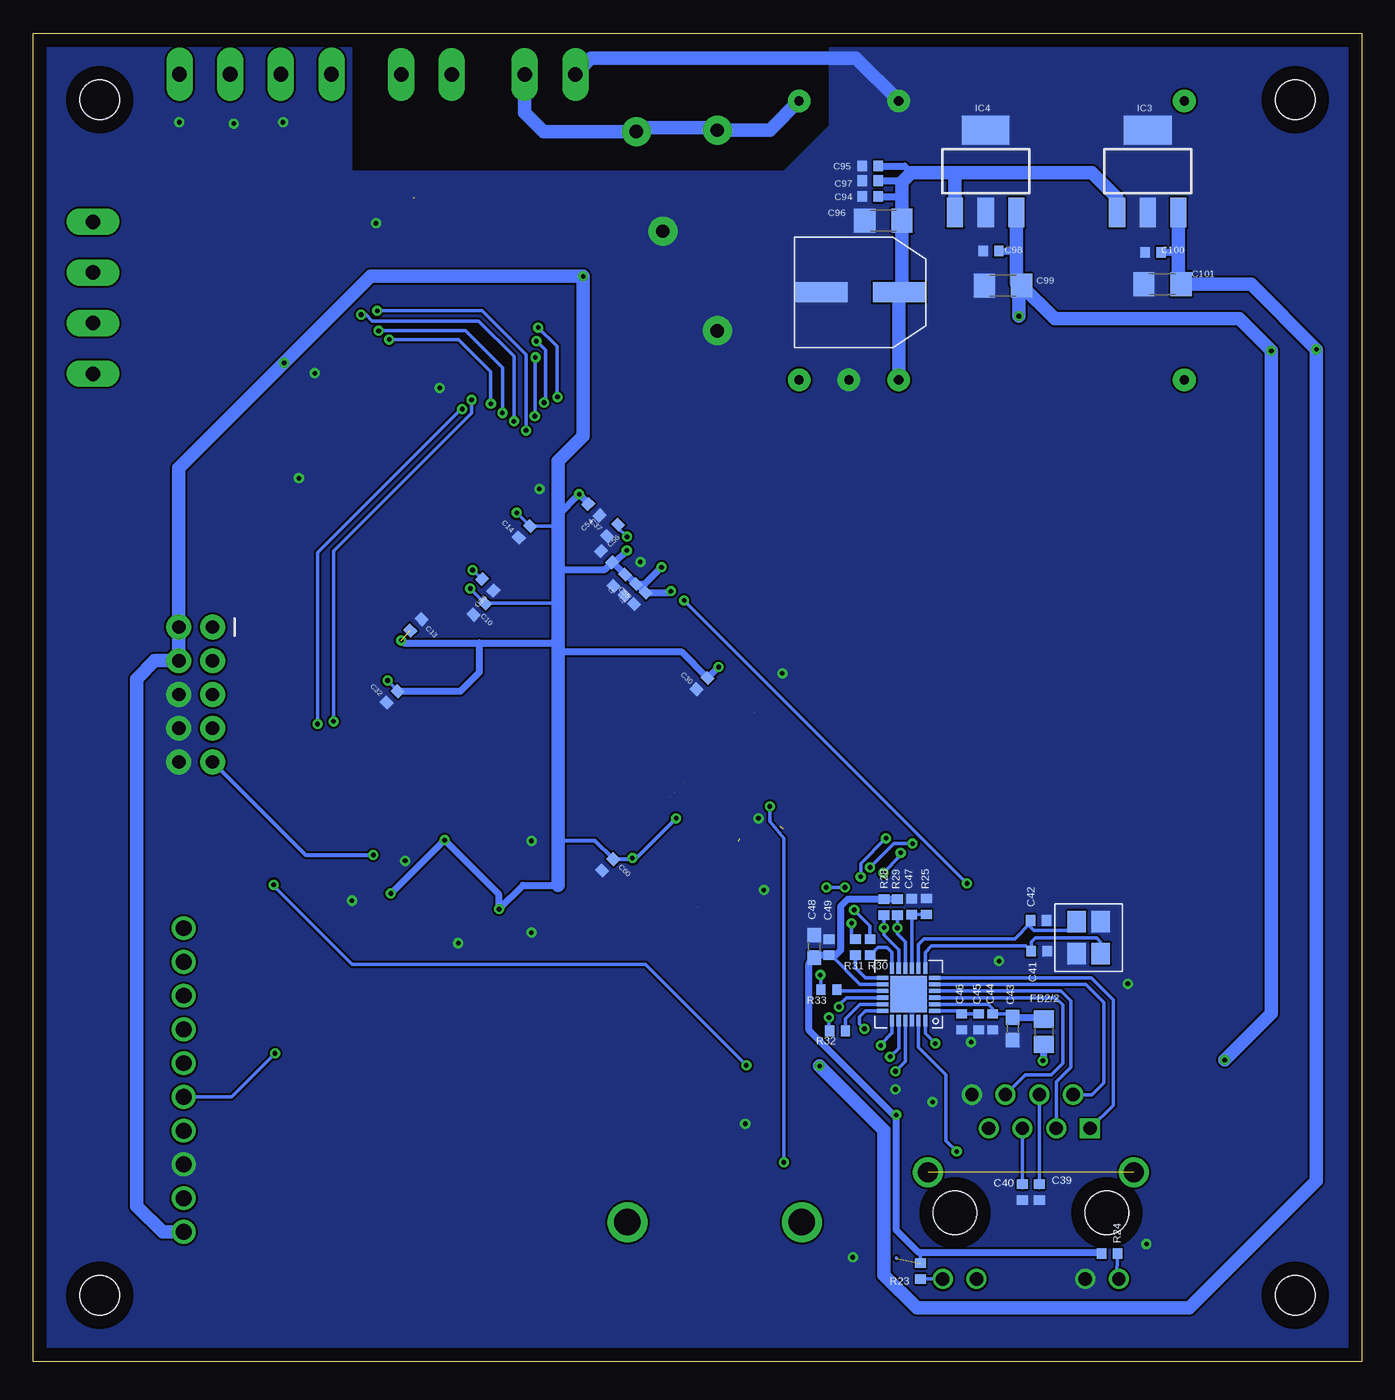
[diagram p8: board, bottom side, seen from below]

Size 100 x 100 mm. Coordinates in mm from the lower left corner, seen from the top.
Outline: 0,0 100,0 100,100 0,100 0,0
Copper layers (1*16): Top 0.035mm / dielectric 1.5mm / Bottom 0.035mm
Design rules "default": minimum track width 6mil, minimum drill 0.35mm, track to track 6mil, track to pad 6mil, pad to pad 6mil, via to via 6mil, smd to smd 6mil, copper to edge 40mil, drill to drill 6mil, minimum pad ring 10mil, minimum via ring 8mil, stop-mask expansion 4mil, vias tented up to drill 0mil, thermal gap 10mil
Holes 3 mm at 5,95 95,95 95,5 5,5

### Footprints (pad centres in the part's own frame; a part is rotated, then mirrored left to right if it is on the bottom)
0402 = smd 0.8 x 0.7: P$1 0,0.6; P$2 0,-0.6
C1210 = smd 1.6 x 2.7: 1 -1.4,0; 2 1.4,0
0603 = smd 1.1 x 1: 1 -0.85,0; 2 0.85,0
CAP_THIN_FILM_32922 = drill 1 pad 2.184: P$1 -0.1,0; P$2 15,0
C1206 = smd 1.6 x 1.8: 1 -1.4,0; 2 1.4,0
0805 = smd 1.3 x 1.5: 1 -0.95,0; 2 0.95,0
SOT223 = smd 1.219 x 2.235: 1 -2.311,-3.099; 2 0,-3.099; 3 2.311,-3.099 | smd 3.6 x 2.2: 4 0,3.099
1X4_3.81MM_PITCH = drill 1.1 pad 2 long: P$1 0,0; P$2 3.81,0; P$3 7.62,0; P$4 11.43,0
USB_MICRO-B = smd 0.4 x 2: P$1 -1.3,2.475; P$2 -0.65,2.475; P$3 0,2.475; P$4 0.65,2.475; P$5 1.3,2.475 | smd 2.1 x 1.6: P$6 -3.1,2.675; P$7 3.1,2.675 | smd 1.9 x 1.8: P$8 -3.525,0; P$9 3.525,0
USB_A_SMT = smd 4 x 0.9: D+ 6.7,-1; D- 6.7,1; GND 6.7,-3.5; VBUS 6.7,3.5 | drill 2: SHLD1 3,-6.566; SHLD2 3,6.566
RJ45_TH_ELEC = drill 1 square: 1 -4.45,-2.54 | drill 1: 2 -3.18,0; 3 -1.91,-2.54; 4 -0.635,0; 5 0.635,-2.54; 6 1.91,0; 7 3.17,-2.54; 8 4.445,0; 9 -6.63,-13.88; 10 -4.09,-13.88; 11 4.09,-13.88; 12 6.63,-13.88 | drill 1.5: 13 -7.75,-5.84; 14 7.75,-5.84 | hole 3.299: 5.715,-8.89; -5.715,-8.89
2_3.81MM_PITCH = drill 1.1 pad 2 long: P$1 0,0; P$2 3.81,0
2X5 = drill 1 pad 1.88: 1 0,0; 2 0,2.54; 3 2.54,0; 4 2.54,2.54; 5 5.08,0; 6 5.08,2.54; 7 7.62,0; 8 7.62,2.54; 9 10.16,0; 10 10.16,2.54
LED_0805_GREEN = smd 1.3 x 1.3: A 0,-1.05; C 0,1.05
SOT-23-5 = smd 1.626 x 0.61: 1 -1.245,0.95; 2 -1.245,0; 3 -1.245,-0.95; 4 1.245,-0.95; 5 1.245,0.95
QFN-24-M = smd 0.864 x 0.305: 1 -1.968,1.25; 2 -1.968,0.75; 3 -1.968,0.25; 4 -1.968,-0.25; 5 -1.968,-0.75; 6 -1.968,-1.25; 13 1.968,-1.25; 14 1.968,-0.75; 15 1.968,-0.25; 16 1.968,0.25; 17 1.968,0.75; 18 1.968,1.25 | smd 0.305 x 0.864: 7 -1.25,-1.968; 8 -0.75,-1.968; 9 -0.25,-1.968; 10 0.25,-1.968; 11 0.75,-1.968; 12 1.25,-1.968; 19 1.25,1.968; 20 0.75,1.968; 21 0.25,1.968; 22 -0.25,1.968; 23 -0.75,1.968; 24 -1.25,1.968 | smd 2.743 x 2.743: 25 0,0
LQFP176_24X24 = smd 1.372 x 0.254: 1 -12.675,10.75; 2 -12.675,10.25; 3 -12.675,9.75; 4 -12.675,9.25; 5 -12.675,8.75; 6 -12.675,8.25; 7 -12.675,7.75; 8 -12.675,7.25; 9 -12.675,6.75; 10 -12.675,6.25; 11 -12.675,5.75; 12 -12.675,5.25; 13 -12.675,4.75; 14 -12.675,4.25; 15 -12.675,3.75; 16 -12.675,3.25; 17 -12.675,2.75; 18 -12.675,2.25; 19 -12.675,1.75; 20 -12.675,1.25; 21 -12.675,0.75; 22 -12.675,0.25; 23 -12.675,-0.25; 24 -12.675,-0.75; 25 -12.675,-1.25; 26 -12.675,-1.75; 27 -12.675,-2.25; 28 -12.675,-2.75; 29 -12.675,-3.25; 30 -12.675,-3.75; 31 -12.675,-4.25; 32 -12.675,-4.75; 33 -12.675,-5.25; 34 -12.675,-5.75; 35 -12.675,-6.25; 36 -12.675,-6.75; 37 -12.675,-7.25; 38 -12.675,-7.75; 39 -12.675,-8.25; 40 -12.675,-8.75; 41 -12.675,-9.25; 42 -12.675,-9.75; 43 -12.675,-10.25; 44 -12.675,-10.75; 89 12.675,-10.75; 90 12.675,-10.25; 91 12.675,-9.75; 92 12.675,-9.25; 93 12.675,-8.75; 94 12.675,-8.25; 95 12.675,-7.75; 96 12.675,-7.25; 97 12.675,-6.75; 98 12.675,-6.25; 99 12.675,-5.75; 100 12.675,-5.25; 101 12.675,-4.75; 102 12.675,-4.25; 103 12.675,-3.75; 104 12.675,-3.25; 105 12.675,-2.75; 106 12.675,-2.25; 107 12.675,-1.75; 108 12.675,-1.25; 109 12.675,-0.75; 110 12.675,-0.25; 111 12.675,0.25; 112 12.675,0.75; 113 12.675,1.25; 114 12.675,1.75; 115 12.675,2.25; 116 12.675,2.75; 117 12.675,3.25; 118 12.675,3.75; 119 12.675,4.25; 120 12.675,4.75; 121 12.675,5.25; 122 12.675,5.75; 123 12.675,6.25; 124 12.675,6.75; 125 12.675,7.25; 126 12.675,7.75; 127 12.675,8.25; 128 12.675,8.75; 129 12.675,9.25; 130 12.675,9.75; 131 12.675,10.25; 132 12.675,10.75 | smd 0.254 x 1.372: 45 -10.75,-12.675; 46 -10.25,-12.675; 47 -9.75,-12.675; 48 -9.25,-12.675; 49 -8.75,-12.675; 50 -8.25,-12.675; 51 -7.75,-12.675; 52 -7.25,-12.675; 53 -6.75,-12.675; 54 -6.25,-12.675; 55 -5.75,-12.675; 56 -5.25,-12.675; 57 -4.75,-12.675; 58 -4.25,-12.675; 59 -3.75,-12.675; 60 -3.25,-12.675; 61 -2.75,-12.675; 62 -2.25,-12.675; 63 -1.75,-12.675; 64 -1.25,-12.675; 65 -0.75,-12.675; 66 -0.25,-12.675; 67 0.25,-12.675; 68 0.75,-12.675; 69 1.25,-12.675; 70 1.75,-12.675; 71 2.25,-12.675; 72 2.75,-12.675; 73 3.25,-12.675; 74 3.75,-12.675; 75 4.25,-12.675; 76 4.75,-12.675; 77 5.25,-12.675; 78 5.75,-12.675; 79 6.25,-12.675; 80 6.75,-12.675; 81 7.25,-12.675; 82 7.75,-12.675; 83 8.25,-12.675; 84 8.75,-12.675; 85 9.25,-12.675; 86 9.75,-12.675; 87 10.25,-12.675; 88 10.75,-12.675; 133 10.75,12.675; 134 10.25,12.675; 135 9.75,12.675; 136 9.25,12.675; 137 8.75,12.675; 138 8.25,12.675; 139 7.75,12.675; 140 7.25,12.675; 141 6.75,12.675; 142 6.25,12.675; 143 5.75,12.675; 144 5.25,12.675; 145 4.75,12.675; 146 4.25,12.675; 147 3.75,12.675; 148 3.25,12.675; 149 2.75,12.675; 150 2.25,12.675; 151 1.75,12.675; 152 1.25,12.675; 153 0.75,12.675; 154 0.25,12.675; 155 -0.25,12.675; 156 -0.75,12.675; 157 -1.25,12.675; 158 -1.75,12.675; 159 -2.25,12.675; 160 -2.75,12.675; 161 -3.25,12.675; 162 -3.75,12.675; 163 -4.25,12.675; 164 -4.75,12.675; 165 -5.25,12.675; 166 -5.75,12.675; 167 -6.25,12.675; 168 -6.75,12.675; 169 -7.25,12.675; 170 -7.75,12.675; 171 -8.25,12.675; 172 -8.75,12.675; 173 -9.25,12.675; 174 -9.75,12.675; 175 -10.25,12.675; 176 -10.75,12.675
TQFP48-M = smd 1.716 x 0.27: 1 -4.201,2.75; 2 -4.201,2.25; 3 -4.201,1.75; 4 -4.201,1.25; 5 -4.201,0.75; 6 -4.201,0.25; 7 -4.201,-0.25; 8 -4.201,-0.75; 9 -4.201,-1.25; 10 -4.201,-1.75; 11 -4.201,-2.25; 12 -4.201,-2.75; 25 4.201,-2.75; 26 4.201,-2.25; 27 4.201,-1.75; 28 4.201,-1.25; 29 4.201,-0.75; 30 4.201,-0.25; 31 4.201,0.25; 32 4.201,0.75; 33 4.201,1.25; 34 4.201,1.75; 35 4.201,2.25; 36 4.201,2.75 | smd 0.27 x 1.716: 13 -2.75,-4.201; 14 -2.25,-4.201; 15 -1.75,-4.201; 16 -1.25,-4.201; 17 -0.75,-4.201; 18 -0.25,-4.201; 19 0.25,-4.201; 20 0.75,-4.201; 21 1.25,-4.201; 22 1.75,-4.201; 23 2.25,-4.201; 24 2.75,-4.201; 37 2.75,4.201; 38 2.25,4.201; 39 1.75,4.201; 40 1.25,4.201; 41 0.75,4.201; 42 0.25,4.201; 43 -0.25,4.201; 44 -0.75,4.201; 45 -1.25,4.201; 46 -1.75,4.201; 47 -2.25,4.201; 48 -2.75,4.201
TMLM04 = drill 0.7 pad 1.7: P$1 21,-25.25; P$2 21,-3.75; P$3 21,0; P$4 21,3.75; P$5 0,3.75; P$6 0,-3.75; P$7 0,-25.25
HEADER_1_X_10_.1_INCH = drill 1.2 pad 1.6: P$1 -24.13,-1.27; P$2 -21.59,-1.27; P$3 -19.05,-1.27; P$4 -16.51,-1.27; P$5 -13.97,-1.27; P$6 -11.43,-1.27; P$7 -8.89,-1.27; P$8 -6.35,-1.27; P$9 -3.81,-1.27; P$10 -1.27,-1.27
SMD_3225 = smd 1.6 x 1.4: 1 -1.2,-0.9; 2 1.2,-0.9; 3 1.2,0.9; 4 -1.2,0.9
XTAL_2.5X2.0 = smd 1.1 x 1.1: 1 -0.875,-0.713; 2 0.875,-0.713; 3 0.875,0.713; 4 -0.875,0.713
VAR_10MM_VDRUS10 = drill 1 pad 2.184: P$1 0,1; P$2 7.5,-1
C_AL_ELECTROLYTIC_SMD_220UF = smd 1.5 x 4: N- 0,2; P+ 0,7.9
SMD_X_2_PADS = smd 1.9 x 1.1: P$1 0,1.25; P$2 0,-1.25

### Placement (x,y rotation side)
C1  55.88,58.82 135 bottom
C2  55.06,58.1 135 bottom
C5  43.1,21.65 0 top
C8  42,21.65 0 top
C10  66.42,56.65 135 bottom
C11  43,16.2 270 top
C13  71.19,55.46 315 bottom
C14  63.02,62.47 135 bottom
C15  42.1,18.8 180 top
C16  61.4,8.5 270 top
C30  49.65,51.04 135 bottom
C31  70.4,38.4 45 top
C32  72.99,50.04 315 bottom
C36  65.79,58.48 225 bottom
C37  56.39,62.58 135 bottom
C38  48.03,42.37 315 top
C39  24.26,12.77 0 bottom
C40  25.54,12.77 0 bottom
C41  24.27,30.89 90 bottom
C42  24.32,33.21 90 bottom
C43  26.26,25.06 270 bottom
C44  27.79,25.58 0 bottom
C45  28.82,25.58 0 bottom
C46  30.1,25.58 0 bottom
C47  33.86,34.24 180 bottom
C48  41.2,31.25 90 bottom
C49  40.1,31.2 180 bottom
C50  46.88,41.24 225 top
C51  47.32,38.77 45 top
C52  49.57,37.7 225 top
C53  51.62,35.6 45 top
C54  57.79,64.13 225 bottom
C55  54.34,57.47 135 bottom
C56  56.85,60.6 45 bottom
C57  73.12,37.3 315 top
C58  51.31,39.66 45 top
C59  74.76,35.84 135 top
C60  56.76,37.4 315 bottom
C61  66.51,32.44 225 top
C71  89.8,74.2 0 top
C72  89.8,78.2 180 top
C73  89.8,82.2 0 top
C74  89.8,86.2 180 top
C75  91.3,90 90 top
C76  87.3,90 270 top
C77  83.3,90 90 top
C78  79.2,90 270 top
C79  73.6,88.2 0 top
C80  69.47,88.2 0 top
C81  66.5,88.2 0 top
C82  64.1,88.2 0 top
C83  61.02,88.2 0 top
C84  56.53,88.2 0 top
C85  77.8,87.9 180 top
C86  76.82,87.9 180 top
C87  80.13,76.57 45 top
C88  79.41,75.87 45 top
C89  79.58,73.69 315 top
C90  80.25,72.97 315 top
C91  78.33,70.77 45 top
C92  81.07,79.47 135 top
C93  48.5,92.6 270 top
C94  37,87.7 270 bottom
C95  37,90 270 bottom
C96  36,85.9 180 bottom
C97  37,88.9 270 bottom
C98  27.9,83.6 270 bottom
C99  27,81 180 bottom
C100  15.7,83.5 270 bottom
C101  15,81.1 180 bottom
FB2/2  23.92,24.83 90 bottom
IC3  16.1,89.6 0 bottom
IC4  28.3,89.6 0 bottom
J1  88.98,96.91 180 top
J2  64.4,1.9 0 top
J3  48.7,7.5 90 top
J4  24.9,20.1 0 top
J5  95.51,74.37 90 top
J9  72.3,96.9 180 top
J10  63,96.9 180 top
J11  86.5,55.3 270 top
LED3  6.8,69 180 top
LED4  3.4,68.9 180 top
R1  46.1,23.5 270 top
R4  62.4,11 0 top
R5  63.8,11 0 top
R6  65.1,11 0 top
R7  61.4,7.5 90 top
R12  44.8,22.3 270 top
R16  71.87,39.86 225 top
R17  71.18,39.17 225 top
R18  73.97,36.63 315 top
R19  52.02,38.16 135 top
R23  33.21,6.82 180 bottom
R24  18.97,8.14 270 bottom
R25  32.76,34.27 0 bottom
R26  29.61,27.88 0 top
R27  28.64,27.88 0 top
R28  35.96,34.22 180 bottom
R29  34.94,34.22 180 bottom
R30  37,31.2 0 bottom
R31  38.1,31.2 0 bottom
R32  39.45,24.9 90 bottom
R33  40.1,28 90 bottom
R76  91.8,74.2 0 top
R77  90.4,72.6 90 top
R78  90.8,74.2 0 top
R79  91.8,78.2 180 top
R80  90.4,76.6 90 top
R81  90.8,78.2 180 top
R82  91.8,82.2 0 top
R83  90.4,80.6 90 top
R84  90.8,82.2 0 top
R85  91.8,86.2 180 top
R86  90.3,84.6 90 top
R87  90.8,86.2 180 top
R88  91.3,92 90 top
R89  92.9,90.6 180 top
R90  91.3,91 90 top
R91  87.3,92 270 top
R92  88.9,90.55 180 top
R93  87.3,91 270 top
R94  83.3,92 90 top
R95  84.9,90.55 180 top
R96  83.3,91 90 top
R97  79.2,92 270 top
R98  80.8,90.54 180 top
R99  79.2,91 270 top
R100  74.1,92.4 90 top
R101  72,92.4 270 top
R102  72,91.2 270 top
R103  74.1,91.2 90 top
R104  74.1,90 90 top
R105  72,90 270 top
R106  71.4,88.2 180 top
R107  72.6,88.2 180 top
R108  70.43,88.2 180 top
R109  68.1,92.4 90 top
R110  66,92.4 270 top
R111  65.97,91.2 270 top
R112  68.1,91.2 90 top
R113  68.1,90 90 top
R114  65.85,90 270 top
R115  65.35,88.2 180 top
R116  67.5,88.2 180 top
R117  62.9,88.2 180 top
R118  61.4,92.4 90 top
R119  59.2,92.4 270 top
R120  59.2,91.2 270 top
R121  61.4,91.2 90 top
R122  61.4,90 90 top
R123  59.3,90 270 top
R124  58.67,88.2 180 top
R125  59.91,88.2 180 top
R126  57.5,88.2 180 top
R127  77.53,69.97 45 top
R128  6.8,73.1 0 top
R129  3.4,73.3 0 top
U2  46.4,19.6 270 top
U3  34.1,27.65 180 bottom
U4  60.5,52 45 top
U6  74.1,79.7 225 top
U7  38.6,94.9 270 top
U$1  87.4,33.9 90 top
U$3  20.55,31.91 270 bottom
U$4  27.11,27.9 0 top
U$6  63.54,83.92 270 top
U$7  53.6,92.6 270 top
U$8  42.7,80.5 270 bottom
X3  44.41,39.2 45 top
X4  48.51,34.39 315 top

### Tracks (layer width: path | path; a pad name or v marks a point on that pad's centre or on a via)
C58
  Bottom 0.254: 24.27,13.1 C39.P$1 J4.4
C60
  Bottom 0.254: 25.54,13.1 C40.P$1 J4.5
CF1
  Top 0.254: U4.164 46.89,58.89 46.89,62.07 59.54,74.72 65.36,74.72 68.56,77.91 68.56,77.92 69.19,78.55 U6.25
CF2
  Top 0.254: U4.163 47.3,59.19 47.3,61.9 59.71,74.31 65.53,74.31 U6.26
CF3
  Top 0.254: U4.161 48.09,59.81 48.09,62.07 59.93,73.91 65.83,73.91 U6.27
CF4
  Top 0.254: U6.28 66.13,73.5 60.1,73.5 48.6,62 48.6,60.01 U4.160
CRS_DV
  Bottom 0.254: U3.15 39.4,27.9 R33.P$2
D+
  Top 0.4: J2.P$3 64.4,8.78 65.1,9.47 R6.P$2
D-
  Top 0.4: J2.P$2 63.75,10.35 R5.P$2
DMA
  Top 0.254: 73.07,74.78 U6.36 72.4,74.11 72.4,72.03 U4.122
ETH  (via drill 0.35)
  Top 0.254: v39.35,26.7 39.35,30.75 37.5,32.6 37.5,35.3 39,36.8 39,40.05 U4.9
  Bottom 0.254: U3.16 38.8,27.4 39.35,26.85 v39.35,26.7
ETH_CRS_DV  (via drill 0.35)
  Top 0.254: v40.75,29.1 41.55,29.9 41.55,39.77 U4.13
  Bottom 0.254: v40.75,29.1 40.7,29.05 R33.P$1
ETH_IRQ14  (via drill 0.35)
  Top 0.254: v37.43,25.05 37.43,22.73 35.89,21.19 34.11,21.19 33.46,21.84 33.46,24.63 R26.P$1 29.65,28.52 29.68,35.98 v29.7,36 | U4.159 51,58.32 v51,57.3
  Bottom 0.254: U3.18 37.35,26.4 37.8,25.95 37.8,25.42 v37.43,25.05 | v51,57.3 v29.7,36
ETH_MDC  (via drill 0.35)
  Top 0.254: v33.8,39 35.4,40.6 36.02,40.6 U4.4 | v37,37.2 37,36.7 36,35.7 36,32.71 v35.95,32.66
  Bottom 0.254: U3.11 34.85,31 35.96,32.11 v35.95,32.66 R28.P$1 | v33.8,39 35.2,39 v37,37.2
ETH_MDIO  (via drill 0.35)
  Top 0.254: v34.94,32.65 34.94,35.85 35.89,36.8 v36,36.8 | v34.7,38.3 34.7,39.3 35.5,40.1 36.23,40.1 U4.5
  Bottom 0.254: U3.10 34.35,31.6 34.94,32.19 v34.94,32.65 R29.P$1 | v34.7,38.3 34.7,38.1 v36,36.8
ETH_RESET  (via drill 0.35)
  Top 0.254: U4.172 44.21,55.91 42.81,55.91 28.7,41.8 28.7,28.54 R27.P$1 27.9,28.48 | 27.9,28.48 27.13,28.48 U$4.P$1 | 27.9,28.48 27.9,26.8 28.5,26.2 29.85,26.2 v32.1,23.95
  Bottom 0.254: U3.24 32.85,24.7 v32.1,23.95
ETH_RX_ER  (via drill 0.35)
  Top 0.254: v40.1,25.9 40.05,25.95 40.05,29.6 41,30.55 41,39.92 U4.12
  Bottom 0.254: R32.P$1 40.1,24.95 v40.1,25.9
ETH_RXD0  (via drill 0.35)
  Top 0.254: v38.4,33 39.65,34.25 39.65,39.99 U4.10
  Bottom 0.254: v38.4,33 38.4,32.1 R31.P$1
ETH_RXD1  (via drill 0.35)
  Top 0.254: v38.9,35.69 38.29,34.09 v38.2,34 | v40.3,35.7 40.3,39.95 47.47,47.12 U4.11
  Bottom 0.254: v38.2,34 37,32.8 R30.P$1 | v40.3,35.7 v38.9,35.69
ETH_TXD0  (via drill 0.35)
  Top 0.254: v35.5,22.95 34.8,23.65 34.8,31.6 34.25,32.15 34.25,36 U4.8
  Bottom 0.254: U3.20 34.85,23.6 v35.5,22.95
ETH_TXD1  (via drill 0.35)
  Top 0.254: v35.1,21.85 34.1,22.85 34.1,31.5 33.8,31.8 33.8,36.24 46.06,48.5 U4.7
  Bottom 0.254: U3.21 34.35,22.6 v35.1,21.85
ETH_TXD_EN  (via drill 0.35)  (1 unrouted)
  Top 0.254: v36.2,23.8 36.71,24.31 36.71,35.5 v37.71,36.5 | v35.8,39.4 36.09,39.69 36.53,39.69 U4.6
  Bottom 0.254: U3.19 35.35,24.75 36.2,23.9 v36.2,23.8 | v35.8,39.4 35.83,39.4 37.71,37.52 v37.71,36.5
GND  (via drill 0.35)
  Top 0.254: R125.P$2 C83.P$1 | R107.P$2 C79.P$1
  Top 0.4: J2.P$5 65.7,8.2
  Top 0.508: C81.P$1 66.51,88.75
  Bottom 1.016: J10.P$2 57.99,98.1 38.05,98.1 U7.P$6
  other vias: 29.4,24.05 32.3,19.55 27.3,30.15 38.3,7.85 16.2,8.85 17.6,28.45 35.1,20.5 46.4,17.9 45,35.5 43.61,51.82 62.5,32.3 72,37.7 62.5,39.2 45.4,40.9 76,34.7 68,31.5 80,66.5 69.4,73.3 78.8,74.4 74.2,85.7 61.9,65.7 54.3,60.2 81.2,93.3 84.9,93.2 89,93.3
  pour Bottom (no thermals): 0,100 40.1,100 40.1,93 43.5,89.6 76,89.6 76,100 100,100 100,0 0,0
  pour Top (no thermals): 0,100 40.1,100 40.1,89.2 76,89.2 76,100 100,100 100,0 0,0
GNDE  (1 unrouted)
  Top 0.508: 39,1.8 39.1,1.9
  Top 0.813: 68.33,1.5 J2.P$9 | J2.P$7 67.92,4.15 | J2.P$6 60.88,4.15 | J2.P$8 57.6,1.9 | J3.SHLD1 55.27,4.23 57.6,1.9 | 57.6,1.9 44.2,1.9 | J3.SHLD2 42.13,3.97 44.2,1.9 | 44.2,1.9 39.1,1.9 38.2,1.9 35.2,4.9 35.2,12.4 33.34,14.26 J4.14
  Top 1.27: 67.92,4.15 J2.P$9 | 60.88,4.15 J2.P$8
  Top 2.25: J2.P$9 J2.P$8
GP4
  Top 0.254: U4.49 63.31,36.81 63.31,36.8
IA_1+
  Top 0.254: R76.P$1 92.63,74.8 93.06,74.37 J5.P$1
IA_2-
  Top 0.254: R79.P$2 92.43,78.8 93.05,78.18 J5.P$2
IAN
  Top 0.254: R81.P$2 C72.P$2
  Top 0.305: U6.4 79.15,82.99 85.41,82.99 89.6,78.8 C72.P$2
IAP
  Top 0.254: R78.P$1 C71.P$1 88.7,75.9 88.7,78.3 84.57,82.43 79.31,82.43 U6.3
IB_1+
  Top 0.254: R82.P$1 92.53,82.8 93.34,81.99 J5.P$3
IB_2-
  Top 0.254: R85.P$2 92.53,86.8 93.53,85.8 J5.P$4
IBN
  Top 0.254: R87.P$2 C74.P$2
  Top 0.305: U6.6 78.85,84.1 86.7,84.1 89.4,86.8 C74.P$2
IBP
  Top 0.254: R84.P$1 C73.P$1
  Top 0.305: U6.5 79,83.54 89.06,83.54 C73.P$1
IC_1+
  Top 0.254: R88.P$1 90.7,95.45 89.24,96.91 J1.P$1
IC_2-
  Top 0.254: R91.P$2 86.7,95.35 85.17,96.88 J1.P$2
ICN
  Top 0.254: R93.P$2 C76.P$2 82.2,85.5 78.84,85.5 U6.8
ICP
  Top 0.254: R90.P$1 C75.P$1 85.63,84.93
  Top 0.305: 85.63,84.93 78.97,84.93 U6.7
IN_1+
  Top 0.254: R94.P$1 82.7,95.6 81.39,96.91 J1.P$3
IN_2-
  Top 0.254: R97.P$2 78.6,95.9 77.59,96.91 J1.P$4
INN
  Top 0.254: R99.P$2 78.63,89.97 C78.P$2
  Top 0.305: C78.P$2 78.6,86.67 U6.10
INP
  Top 0.254: R96.P$1 82.73,89.84 C77.P$1
  Top 0.305: C77.P$1 82.7,87.27 81.59,86.15 78.79,86.15 U6.9
INT_AI_LS_1
  Top 0.254: U4.43 58.79,35.76
IRQ0  (via drill 0.35)
  Top 0.254: U6.30 67,72.95 v67,72.4 | U4.86 77.4,48.89 v77.4,48.2
  Bottom 0.254: v67,72.4 67,71.4 77.4,61 v77.4,48.2
IRQ1  (via drill 0.35)
  Top 0.254: U6.31 67.7,72.95 v67.7,71.7 | U4.87 78.6,48.4 v78.6,48
  Bottom 0.254: v67.7,71.7 67.8,71.7 78.6,60.9 v78.6,48
LED1/SPEED  (via drill 0.35)
  Top 0.254: J4.11 28.99,6.29 27.82,7.45 27.82,13.15 v30.48,15.81
  Bottom 0.254: U3.23 33.35,23.65 31.3,21.6 31.3,16.63 v30.48,15.81
M0_STEP
  Top 0.254: U4.16 49.24,45.32
M3_STEP
  Top 0.254: U4.38 57.02,37.42
N$1  (via drill 0.35)
  Top 0.254: v55.3,62.1 55,62.1 U4.148
  Bottom 0.254: C37.P$2 55.97,62.77 v55.3,62.1
N$4
  Top 0.254: U4.19 48.82,42.8 C38.P$1
N$5
  Top 0.254: U4.62 69.98,39.34 C31.P$1
N$6
  Top 0.254: R17.P$2 70.76,39.97 U4.64
N$7
  Top 0.254: U4.65 71.15,40.29 R16.P$2
N$8  (1 unrouted)
  Top 0.254: 52.52,40.84 U4.27 52.1,40.42 52.1,40.03 52.54,39.59 52.54,38.68 R19.P$2
N$35
  Top 0.254: R76.P$2 R78.P$2 91,73.4 R77.P$2
N$36
  Top 0.254: R80.P$2 91,77.4 R81.P$1 R79.P$1
N$37
  Top 0.254: R83.P$2 91,81.4 R84.P$2 R82.P$2
N$38
  Top 0.254: R86.P$2 90.9,85.5 R87.P$1 R85.P$1
N$39
  Top 0.254: R89.P$2 92.1,91.2 R90.P$2 R88.P$2
N$40
  Top 0.254: R91.P$1 R93.P$1 88.05,91.15 R92.P$2
N$41
  Top 0.254: R94.P$2 83.94,90.87 R96.P$2 83.93,91.03 R95.P$2
N$42
  Top 0.254: R98.P$2 80.8,91 R99.P$1 79.84,90.97 R97.P$1
N$43
  Top 0.254: R101.P$1 R100.P$1
N$44
  Top 0.254: R102.P$2 R101.P$2
N$45
  Top 0.254: R103.P$1 R102.P$1
N$46
  Top 0.254: R104.P$2 R103.P$2
N$47
  Top 0.254: R105.P$1 R104.P$1
N$48
  Top 0.254: R106.P$2 R105.P$2
N$49
  Top 0.254: R110.P$1 R109.P$1
N$50
  Top 0.254: R111.P$2 65.37,92.07 R110.P$2
N$51
  Top 0.254: R112.P$1 R111.P$1
N$52
  Top 0.254: R113.P$2 R112.P$2
N$53
  Top 0.254: R114.P$1 R113.P$1
N$54
  Top 0.254: R115.P$2 65.25,88.8 R114.P$2
N$55
  Top 0.254: R119.P$1 R118.P$1
N$56
  Top 0.254: R120.P$2 R119.P$2
N$57
  Top 0.254: R121.P$1 R120.P$1
N$58
  Top 0.254: R122.P$2 R121.P$2
N$59
  Top 0.254: R123.P$1 R122.P$1
N$60
  Top 0.254: R124.P$2 58.67,89.67 R123.P$2
N$61
  Top 0.508: R128.P$2 LED3.A
N$62
  Top 0.508: R129.P$2 LED4.A
OSCI
  Top 0.254: U6.20 68.82,83.92 63.19,83.92 62.83,84.28 U$6.1
OSCO
  Top 0.254: U$6.3 68.99,83.04 U6.21
P5_11
  Top 0.254: U4.176 43.9,53.4
P8_04
  Top 0.254: U4.137 57.68,67.19 57.68,67.2
P9_05
  Top 0.254: U4.73
P9_06
  Top 0.254: U4.72
P9_07
  Top 0.254: U4.71 71.05,44.62 71.19,44.48
P9_08
  Top 0.254: U4.70 70.72,44.27
PM0
  Top 0.254: U4.126 70.9,73.36 70.9,74.73 U6.33
PM1
  Top 0.254: U6.34 71.4,74.53 71.4,73.15 U4.125
R51
  Bottom 0.254: R23.P$1 J4.12
R52
  Bottom 0.254: R24.P$1 18.45,6.22 J4.9
RELAY_6
  Top 0.254: U4.51
RELAY_7
  Top 0.254: U4.50 63.65,37.2
RESET  (via drill 0.35)
  Top 0.254: 74.4,38.14 v74.41,38.15 74.71,37.85 74.71,37.37 R18.P$1 74.21,37.06 C57.P$1 73.54,39.31 U4.67
  Bottom 0.305: J11.9 79.51,38.15 v74.41,38.15
REXT
  Bottom 0.152: U3.9
  Bottom 0.254: U3.9 33.85,33.63 C47.P$1 33.83,33.67 R25.P$2
RST
  Top 0.254: U6.41 76.6,76.2 78,74.8 78,71.3 C91.P$1 R127.P$1 75.7,71.8 72.88,71.8 U4.121
RXD0
  Bottom 0.254: U3.13 37.35,28.9 38.1,29.65 R31.P$2
RXD1
  Bottom 0.254: U3.12 35.35,30.8 35.75,31.2 36.4,31.2 R30.P$2
RXER
  Bottom 0.254: U3.17 37.75,26.9 38.85,25.8 R32.P$2
RXM
  Bottom 0.254: J4.6 25.31,21.6 23.35,21.6 22.5,22.45 22.5,26.85 23.05,27.4 U3.3
RXP
  Bottom 0.254: U3.4 22.65,27.9 21.89,27.14 21.89,22.16 22.99,21.06 J4.3
SD1_CD
  Top 0.254: 54.46,64.05 U4.146
SD1_WP
  Top 0.254: U4.147 54.19,63.63
SPI_0_CS_0  (via drill 0.35)
  Top 0.254: 75.11,74.77 U6.37 73.2,76.71 v73.2,76.94 | U4.129 65.55,70.13 v65.55,72.11
  Bottom 0.254: v65.55,72.11 65.55,74.51 67.98,76.94 v73.2,76.94
SPI_0_MISO  (via drill 0.35)
  Top 0.254: U4.132 62.9,69.6 v62.9,70.1 | v74.1,79.1 74.7,78.5 74.7,76.62 U6.39
  Bottom 0.254: v62.9,70.1 62.9,75.8 66.2,79.1 v74.1,79.1
SPI_0_MOSI  (via drill 0.35)
  Top 0.254: U4.131 62.25,68.21 63.91,69.86 63.91,70.69 v63.81,70.78 | U6.40 75.29,76.75 75.29,78.79 v75.31,78.81
  Bottom 0.254: v75.31,78.81 74.94,78.81 74.47,78.34 66.47,78.34 63.81,75.69 v63.81,70.78
SPI_0_SCLK  (via drill 0.35)
  Top 0.254: U4.130 64.68,69.97 v64.68,71.42 | v74,77.6 74,76.62 U6.38
  Bottom 0.254: v64.68,71.42 64.68,74.82 67.46,77.6 v74,77.6
SPI_1_CS_0
  Top 0.254: U4.55 79.36,25.01 U$1.P$7
SPI_1_MISO  (via drill 0.35)
  Top 0.254: U4.54 80.46,23.2 v81.8,23.2
  Bottom 0.254: v81.8,23.2 85.07,19.93 U$1.P$5
SPI_1_MOSI
  Top 0.254: U4.53 80.48,22.47 U$1.P$6
SPI_1_SCLK
  Top 0.254: U4.52 84.86,17.39 U$1.P$4
TCK
  Top 0.254: J11.7 80.02,47.68 U4.88
TDI
  Top 0.254: U4.91 77.94,55.65 78.42,55.65 78.42,55.66 86.14,55.66 J11.1
TDO
  Top 0.254: U4.90 77.98,54.98 79.11,54.98 84.28,54.98 J11.3
TMS
  Top 0.254: U4.89 77.86,54.16 78.67,54.16 82.56,54.16 J11.5
TXM
  Bottom 0.254: U3.5 20.75,28.4 19.4,27.05 19.4,21 20.3,20.1 J4.2
TXP
  Bottom 0.254: U3.6 20.35,28.9 18.7,27.25 18.7,19.31 J4.1
UA
  Top 0.254: R100.P$2 74.7,94.9 72.7,96.9 J9.P$1
UB
  Top 0.254: R109.P$2 68.7,95.08 68.49,95.29 J9.P$2
UC
  Top 0.254: J10.P$1 63,94.3 62,93.3 R118.P$2
  Bottom 1.016: J10.P$1 63,94 61.6,92.6 U$7.P$1 54.3,92.9 48.5,92.9 C93.P$1 44.55,92.7 U7.P$5
USB_N
  Top 0.254: U4.46 63.8,34.2 R5.P$1
USB_P
  Top 0.254: R6.P$1 65.1,12.95 64.25,13.8 64.25,34.46 U4.47
USB_VBUS_B
  Top 0.254: R4.P$1 62.4,12.9 63.3,13.8 63.3,29.27 58.5,34.07 58.5,34.8 U4.44
USBHS_FAULT  (via drill 0.35)
  Top 0.254: U2.3 45.4,20.89 R12.P$1 v46.32,22.3 | v81.9,35.9 81.9,38.73 U4.78
  Bottom 0.254: v46.32,22.3 53.92,29.9 76,29.9 81.9,35.8 v81.9,35.9
USBHS_N
  Top 0.254: J3.D- 47.7,16.7 48.4,17.4 48.4,28.7 53.3,33.6 53.3,38.79 U4.31
USBHS_P
  Top 0.254: J3.D+ 49.7,16.7 48.9,17.5 48.9,28.52 53.71,33.33 53.71,38.49 U4.32
USBHS_VBUS  (via drill 0.35)
  Top 0.254: U2.5 47.35,17.86 45.2,15.71 | 45.2,15.71 45.2,16.2 C11.P$1 43.6,16.4 43.6,18.7 C15.1 | 45.2,15.71 J3.VBUS | v44.55,41.8 46.85,44.1 48.71,44.1 U4.17
  Top 0.508: U2.5 47.4,18.3 | v43.5,15 43.5,16.3 43.6,16.4
  Bottom 0.254: v43.5,15 43.5,39.37 44.55,40.66 v44.55,41.8
USBHS_VBUSEN
  Top 0.254: R1.P$1 47.4,22.8 47.4,20.89 U2.1
VAN
  Top 0.254: U6.14 70.43,86.55 R108.P$1 C80.P$2
VAP  (1 unrouted)
  Top 0.254: R107.P$1 72.6,85.09 U6.13 | C79.P$2 R107.P$1 | R107.P$1 71.3,87.6
VBN
  Top 0.254: U6.16 69.08,86.49 64.61,86.49 64.1,87 C82.P$2 R117.P$1
VBP
  Top 0.254: U6.15 69.37,86.91 66.99,86.91 66.5,87.4 C81.P$2 | C81.P$2 R115.P$1 | C81.P$2 67.45,87.5 67.49,87.54
  Top 0.508: R115.P$1 65.4,87.45 | 66.47,87.57 C81.P$2 | 67.49,87.54 R116.P$1
VBUS
  Top 0.4: J2.P$1 63.1,7.5 | 63.1,7.5 63.1,8.5 | R4.P$2 62.4,9.38 63.1,8.68 63.1,8.5 | R7.P$2 63.1,7.5 | C16.P$1 63.1,8.5
VCC
  Bottom 0.508: C95.P$1 34.4,90 33.9,89.5 | C97.P$1 34.7,88.9 34.6,88.8 | C94.P$1 34.7,87.7 34.6,87.8
  Bottom 1.016: U7.P$2 34.85,80.45 U$8.P+ 34.6,80.7 C96.1 34.6,87.8 34.6,88.8 33.9,89.5 30.61,89.5 | 30.61,89.5 IC4.1 | 30.61,89.5 20.3,89.5 18.41,87.61 IC3.1
VCL_F(FLASH)  (via drill 0.35)
  Top 0.254: U4.112 67.03,59.59 v66.92,59.59
  Bottom 0.254: C36.P$2 v66.92,59.58 v66.92,59.59
VCN
  Top 0.254: U6.18 68.49,85.66 63.93,85.66 63.19,86.4 58.7,86.4 R126.P$1 57.47,87.53 C84.P$2
VCP
  Top 0.254: U6.17 68.79,86.07 64.24,86.07 63.41,86.9 60.61,86.9 R125.P$1 | C83.P$2 R125.P$1 | R125.P$1 R124.P$1
VDD  (via drill 0.35)  (2 unrouted)
  Top 0.254: 32.95,20.65 32.95,24.25 29.92,27.28 R26.P$2 R27.P$2 | U4.61 69.03,39.58 v69.03,39.27 | U4.97 72.35,54.3 v72.3,54.3 | U4.149 v55.32,61.07 | U4.25 51.6,41.33 v51.6,40.9 | U4.26 51.88,40.9 v51.6,40.9 | U4.34 54.9,38.27 v54.9,37.9 | U4.48 64.94,34.48 v64.94,34.06 64.94,34.01 C61.P$2 | R18.P$2 73.5,36.26 | U4.84 75.65,49.25 73.62,51.28 v73.32,51.28 | 73.5,36.28 R18.P$2 | R18.P$2 73.51,36.21 73.08,35.78 v73.08,35.24 73.43,34.9 73.9,34.9 74.34,35.34 C59.P$1 | v51.6,40.9 51.6,40.8 C58.P$1 | U4.171 48.4,52.43 v48.4,52.29 | U4.123 65.04,65.34 v63.6,63.9 | U4.110 67.1,58.25 v67.1,58.2 | U4.154 52.7,60.15 v52.7,59.8 52.35,59.8 U4.155 | U4.158 52,58.02 v52,58 | U6.1 80.65,79.09 C92.P$1 81.4,78.29 81.4,76.99 C87.P$2 | C87.P$2 79.86,75.45 C88.P$2 80.09,75.19 v81.11,75.19 81.5,74.8 81.5,72 79,69.5 78,69.5 R127.P$2 | C87.P$2 80.56,77.13 U6.48 | U4.138 58.87,65.3 v58.9,65.3
  Top 0.508: 30.95,22.65 32.95,20.65 v35.03,18.57 | v6.8,76.1 R128.P$1
  Top 1.016: v58.6,81.7 58.55,81.75 28.85,81.75 v25.8,78.7 | v10.3,22.7 23.95,22.7 v24,22.65 24.04,22.69 30.91,22.69 v35.03,18.57
  Bottom 0.152: U3.14 36.09,28.38
  Bottom 0.254: U3.14 37.75,28.4 39.95,30.6 C49.P$1 | C32.P$1 72.56,50.52 v73.32,51.28 | v73.08,35.24 73.09,35.24 | 60.5,62.8 60.6,62.9 C14.P$2 v63.6,63.9 | 60.5,57.1 65.97,57.1 C10.P$2 67.1,58.18 v67.1,58.2 | 35.02,7.79 35.03,7.8 | R23.P$2 33.21,8.08 33.37,8.24
  Bottom 0.305: 60.5,39.2 57.71,39.2 C60.P$1 54.98,37.82 v54.9,37.9 54.6,37.9 v51.6,40.9
  Bottom 0.508: v24,22.65 23.92,22.73 FB2/2.1 | R29.P$2 R28.P$2 38.68,34.82 39.2,34.3 39.2,30.98 39.58,30.6 C49.P$1 41,30.6 C48.1 41.6,30 41.6,24.93 35.24,18.57 v35.03,18.57 35.03,9.9 33.37,8.24 19.67,8.24 R24.P$2 | 56.26,37.9 C60.P$1 | 60.5,35.87 63.13,35.87 v64.94,34.06 64.94,35.16 v69.03,39.27 73.06,35.24 v73.08,35.24 | 60.7,50.5 60.5,50.3 | 60.7,61 60.5,61 | 60.5,62.8 60.5,63.7 v58.9,65.3 58.22,64.62 C54.P$2 | C99.1 25.7,80.9 26,81.2 | IC4.3 | C98.P$1 26.09,83.6 25.99,83.7 | v72.3,54.3 72.1,54.1 66.4,54.1 | 66.4,54.1 60.5,54.1 | C32.P$1 67.83,50.47 66.4,51.9 66.4,54.1 | C2.P$2 54.55,58.52 C55.P$2 52.11,57.89 v52,58 | C2.P$2 55.35,59.24 C1.P$2 56.38,60.17 C56.P$2 | C56.P$2 56.99,59.6 60.5,59.6 | C30.P$2 51.16,53.4 60.5,53.4 | C30.P$2 | C30.P$2 v48.4,52.29 | C2.P$2 53.98,58.52 v52.7,59.8 | C56.P$2 56.22,60.17 v55.32,61.07
  Bottom 1.016: 60.5,35.87 60.5,39.2 60.5,50.3 60.5,53.4 60.5,54.1 60.5,57.1 60.5,59.6 60.5,61 60.5,62.8 60.5,67.78 58.6,69.68 v58.6,81.7 74.6,81.7 v81.11,75.19 89.04,67.26 J11.2 J11.4 90.84,52.76 92.2,51.4 92.2,11.7 90.27,9.77 U$1.P$1 | IC4.3 25.99,83.7 25.99,81.19 25.7,80.9 | v25.8,78.7 25.8,80.8 C99.1 23.1,78.5 9.2,78.5 v6.8,76.1 6.8,26.2 v10.3,22.7
VDD1P8
  Top 0.254: 76.89,76.53 U6.42 77.67,75.77 78.37,75.77 | 78.37,75.77 80,74.14 C89.P$1 80.67,73.45 C90.P$1 | 78.37,75.77 U6.43
VDD5  (via drill 0.35)
  Top 0.254: R1.P$2 45,23.5 44.2,22.7 R12.P$2 44.15,22.25 C5.P$1 C8.P$1 v40.8,22.25
  Top 0.508: 45.41,18.4 U2.4 44.71,19.1 44.71,20.32 44.2,20.82 R12.P$2 | v3.4,76.2 R129.P$1
  Bottom 0.508: 15.19,83.59 C100.P$1 13.89,83.5 13.79,83.6 | 13.7,81.2 C101.1
  Bottom 1.016: 13.55,81.15 C101.1 8.3,81.1 v3.4,76.2 3.4,13.6 12.96,4.04 33.48,4.04 35.94,6.5 35.94,17.39 v40.8,22.25 | IC3.3 13.79,83.6 13.79,81.29 13.7,81.2
VDD_1.2
  Bottom 0.254: U3.1 30.32,26.4 C46.P$1 C45.P$1
VDD_ENET1
  Bottom 0.254: C44.P$1 27.79,26.41 | 26.36,25.81 C43.1 26.53,26.18 C44.P$1 | C44.P$1 27.79,26.59 28.09,26.9 U3.2
  Bottom 0.508: 26.22,25.95 C43.1 24.05,25.91 FB2/2.2
VREF
  Top 0.254: U6.11 77.42,86.2 77.8,86.53 C85.P$1 C86.P$1
WARNOUT
  Top 0.254: U6.29 70.6,77.14 66.31,72.85 66.31,70.19 U4.128
XCIN  (1 unrouted)
  Top 0.2: 43.95,40.51 43.74,40.29
  Top 0.254: U4.20 47.55,40.82 C50.P$1 46.57,40.08 X3.P$1
XCOUT  (2 unrouted)
  Top 0.254: 46.8,39.39 47.31,39.87 U4.21 | C51.P$1 46.02,38.31 X3.P$2
XII
  Bottom 0.254: U3.8 33.35,31.4 32.94,31.81 26.12,31.81 24.92,33.01 C42.P$1 24.92,32.71 24.66,32.45 22.11,32.45 U$3.1
XOO
  Bottom 0.254: U3.7 32.85,30.82 32.38,31.29 25.27,31.29 C41.P$1 24.87,31.58 24.55,31.9 19.95,31.9 19.65,31.61 U$3.3
XTAL1  (1 unrouted)
  Top 0.152: 47.09,34.53 X4.1
  Top 0.254: U4.23 49.5,40.65 49.5,38.74 49.96,38.28 49.96,37.32 C52.P$1 50,35.9 48.63,34.53 47.09,34.53
XTAL2  (2 unrouted)
  Top 0.2: 50.06,34.25 X4.3
  Top 0.254: X4.3 51.19,35.38 C53.P$1 51.19,37.04 50.37,37.87 50.37,38.45 49.91,38.91 49.91,40.35 U4.24
ZX0  (via drill 0.35)
  Top 0.254: U6.22 69.89,81.44 69.07,82.26 66.39,82.26 v61.98,77.85 | v60.53,72.61 60.09,72.61 57.83,70.36 57.83,68.46 U4.135
  Bottom 0.254: v60.53,72.61 60.56,72.64 60.56,76.44 v61.98,77.85
ZX1  (via drill 0.35)
  Top 0.254: v61.55,72.19 61.1,72.19 58.26,69.35 58.26,68.74 U4.134 | 69.22,81.42 U6.23 68.86,81.75 67.05,81.75 v62.12,76.83
  Bottom 0.254: v62.12,76.83 61.45,76.15 61.45,72.29 v61.55,72.19
ZX2  (via drill 0.35)
  Top 0.254: U4.133 58.84,68.86 58.84,69.04 60.98,71.18 v62.24,71.18 | U6.24 68.59,81.32 67.92,81.32 v62.2,75.6
  Bottom 0.254: v62.2,75.6 62.24,75.56 v62.24,71.18

### Text on the board
tNames: 1 | 2 | TDI | VDD | TDO | VDD | TMS | GND | TCK | GND | RESET | GND | 9 | 10